# EAGLE design Dashboard rev3 (EAGLE 9.6.2)

## Sheet 1 of 2
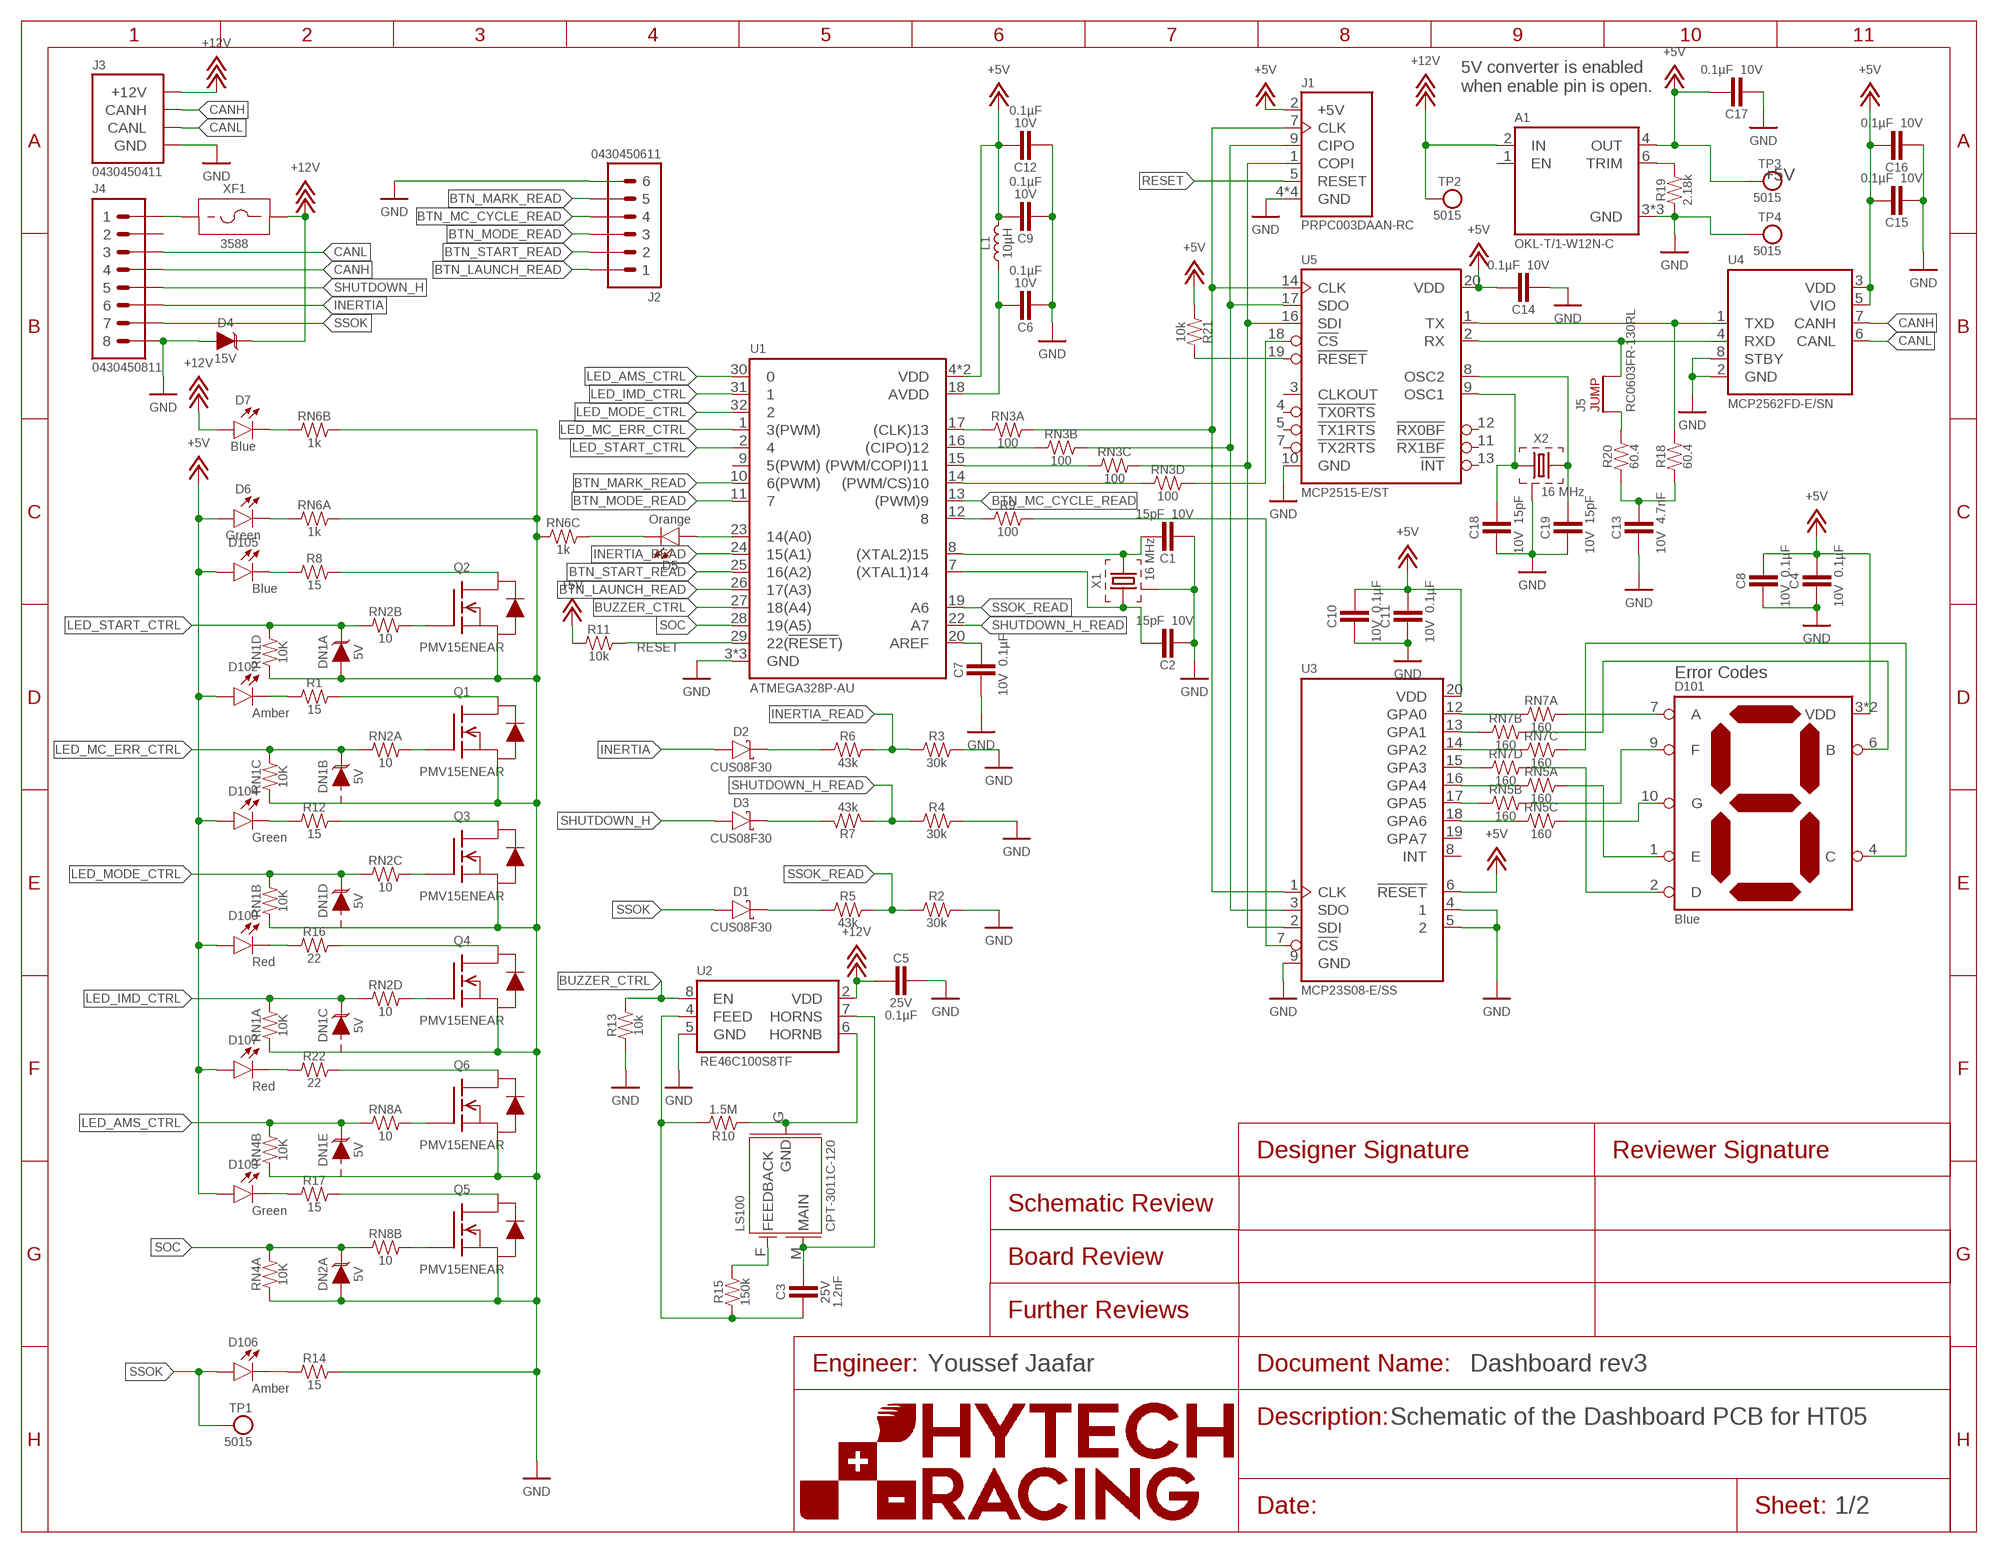
[diagram p0: schematic, sheet 1]

### Parts
A1  OKL-T/1-W12N-COKL  [OKL-T/1-W12]
C1  CAPACITOR_0603_10V_15PF  [0603-CAP]
C2  CAPACITOR_0603_10V_15PF  [0603-CAP]
C3  CAPACITOR_0603_25V_1.2NF  [0603-CAP]
C4  CAPACITOR_0603_10V_0.1UF  [0603-CAP]
C5  CAPACITOR_0603_25V_0.1UF  [0603-CAP]
C6  CAPACITOR_0603_10V_0.1UF  [0603-CAP]
C7  CAPACITOR_0603_10V_0.1UF  [0603-CAP]
C8  CAPACITOR_0603_10V_0.1UF  [0603-CAP]
C9  CAPACITOR_0603_10V_0.1UF  [0603-CAP]
C10  CAPACITOR_0603_10V_0.1UF  [0603-CAP]
C11  CAPACITOR_0603_10V_0.1UF  [0603-CAP]
C12  CAPACITOR_0603_10V_0.1UF  [0603-CAP]
C13  CAPACITOR_0603_10V_4.7NF  [0603-CAP]
C14  CAPACITOR_0603_10V_0.1UF  [0603-CAP]
C15  CAPACITOR_0603_10V_0.1UF  [0603-CAP]
C16  CAPACITOR_0603_10V_0.1UF  [0603-CAP]
C17  CAPACITOR_0603_10V_0.1UF  [0603-CAP]
C18  CAPACITOR_0603_10V_15PF  [0603-CAP]
C19  CAPACITOR_0603_10V_15PF  [0603-CAP]
D1  SCHOTTKY_SOD323_30V  [SOD-323]
D2  SCHOTTKY_SOD323_30V  [SOD-323]
D3  SCHOTTKY_SOD323_30V  [SOD-323]
D4  TVS_15V  [SOT-23]
D5  LED_0603_ORANGE  [0603-LED]
D6  LED_0603_GREEN  [0603-LED]
D7  LED_0603_BLUE  [0603-LED]
D100  LED_2835_RED  [2835-LED]
D101  LED_7_SEGMENT_BLUE_DSM7TA  [DSM7T]
D102  LED_2835_AMBER  [2835-LED]
D103  LED_2835_GREEN  [2835-LED]
D104  LED_2835_GREEN  [2835-LED]
D105  LED_2835_BLUE  [2835-LED]
D106  LED_2835_AMBER  [2835-LED]
D107  LED_2835_RED  [2835-LED]
DN1  TVS_ARRAY_5V  [SOT-363]
DN2  TVS_ARRAY_5V  [SOT-363]
J1  CONNECTOR-AVR-ISP_2X05_SMD  [2X05_SMD]
J2  CONNECTOR-6_μF_S_RA_  [MOLEX_MICROFIT_SMD_RIGHTANGLE_06_DUAL]
J3  CONNECTOR-CAN_μF_S_RA_  [MOLEX_MICROFIT_SMD_RIGHTANGLE_04_DUAL]
J4  CONNECTOR-8_μF_S_RA_  [MOLEX_MICROFIT_SMD_RIGHTANGLE_08_DUAL]
J5  JUMPER_0603_  [0603-RES]
L1  INDUCTOR_LQM18DH100M70_10UH  [0603-IND]
LS100  BUZZER_3_PIN_CPT-3011C-120  [CPT-3011C-120]
Q1  TRANSISTOR_N_MOS__PMV15ENEA  [SOT-23]
Q2  TRANSISTOR_N_MOS__PMV15ENEA  [SOT-23]
Q3  TRANSISTOR_N_MOS__PMV15ENEA  [SOT-23]
Q4  TRANSISTOR_N_MOS__PMV15ENEA  [SOT-23]
Q5  TRANSISTOR_N_MOS__PMV15ENEA  [SOT-23]
Q6  TRANSISTOR_N_MOS__PMV15ENEA  [SOT-23]
R1  RESISTOR_0603_15  [0603-RES]
R2  RESISTOR_0603_30K  [0603-RES]
R3  RESISTOR_0603_30K  [0603-RES]
R4  RESISTOR_0603_30K  [0603-RES]
R5  RESISTOR_0603_43K  [0603-RES]
R6  RESISTOR_0603_43K  [0603-RES]
R7  RESISTOR_0603_43K  [0603-RES]
R8  RESISTOR_0603_15  [0603-RES]
R9  RESISTOR_0603_100  [0603-RES]
R10  RESISTOR_0603_1.5M  [0603-RES]
R11  RESISTOR_0603_10K  [0603-RES]
R12  RESISTOR_0603_15  [0603-RES]
R13  RESISTOR_0603_10K  [0603-RES]
R14  RESISTOR_0603_15  [0603-RES]
R15  RESISTOR_0603_150K  [0603-RES]
R16  RESISTOR_0805_22  [0805-RES]
R17  RESISTOR_0603_15  [0603-RES]
R18  RESISTOR_0603_60.4  [0603-RES]
R19  RESISTOR_0603_2.18K  [0603-RES]
R20  RESISTOR_0603_60.4  [0603-RES]
R21  RESISTOR_0603_10K  [0603-RES]
R22  RESISTOR_0805_22  [0805-RES]
RN1  RESISTOR_NETWORK_4_10K  [1206-RES-ARRAY]
RN2  RESISTOR_NETWORK_4_10  [1206-RES-ARRAY]
RN3  RESISTOR_NETWORK_4_100  [1206-RES-ARRAY]
RN4  RESISTOR_NETWORK_4_10K  [1206-RES-ARRAY]
RN5  RESISTOR_NETWORK_4_160  [1206-RES-ARRAY]
RN6  RESISTOR_NETWORK_4_1K  [1206-RES-ARRAY]
RN7  RESISTOR_NETWORK_4_160  [1206-RES-ARRAY]
RN8  RESISTOR_NETWORK_4_10  [1206-RES-ARRAY]
TP1  TEST_POINT  [5015]
TP2  TEST_POINT  [5015]
TP3  TEST_POINT  [5015]
TP4  TEST_POINT  [5015]
U1  ATMEGA328P-AU  [TQFP-32]
U2  RE46C100  [SOIC-08(NARROW,0.15")]
U3  MCP23S08  [SSOP-20]
U4  MCP2562FD  [SOIC-08(NARROW,0.15")]
U5  MCP2515  [TSSOP-20]
X1  CRYSTAL_16MHZ  [ECX-42]
X2  CRYSTAL_16MHZ  [ECX-42]
XF1  FUSE_HOLDER_MINIBLADESMD  [3588]

### Nets
+5V: A1.4(OUT) C4.1 C8.1 C9.1 C10.1 C11.1 C12.1 C14.1 C15.1 C16.1 C17.1 D6.2(A) D100.A D101.3(VDD) D101.8(VDD) D102.A D103.A D104.A D105.A D107.A J1.2(+5V) L1.2 R11.1 R21.1 TP3.1 U1.4(VDD) U1.6(VDD) U3.6(!RESET) U3.20(VDD) U4.3(VDD) U4.5(VIO) U5.20(VDD)
+12V: A1.2(IN) C5.2 D4.3(C) D7.2(A) J3.1(+12V) TP2.1 U2.2(VDD) XF1.3 XF1.4
A2: RN7.1 U3.12(GPA0)
B2: RN7.2 U3.13(GPA1)
BTN_LAUNCH_READ: J2.1 U1.26(17(A3))
BTN_MARK_READ: J2.5 U1.10(6(PWM))
BTN_MC_CYCLE_READ: J2.4 U1.13((PWM)9)
BTN_MODE_READ: J2.3 U1.11
BTN_START_READ: J2.2 U1.25(16(A2))
BUZZER_CTRL: R13.2 U1.27(18(A4)) U2.8(EN)
C2: RN7.3 U3.14(GPA2)
CANH: J3.4(CANH) J4.4 U4.7(CANH)
CANL: J3.3(CANL) J4.3 U4.6(CANL)
D2: RN7.4 U3.15(GPA3)
E2: RN5.1 U3.16(GPA4)
F2: RN5.2 U3.17(GPA5)
G2: RN5.3 U3.18(GPA6)
GND: A1.3(GND) A1.7(GND) A1.11(GND) C1.2 C2.2 C4.2 C5.1 C6.2 C7.2 C8.2 C9.2 C10.2 C11.2 C12.2 C13.2 C14.2 C15.2 C16.2 C17.2 C18.2 C19.2 D4.1(A) DN1.2(A:A) DN2.2(A:A) J1.4(GND) J1.6(GND) J1.8(GND) J1.10(GND) J2.6 J3.2(GND) J4.8 Q1.2(S) Q2.2(S) Q3.2(S) Q4.2(S) Q5.2(S) Q6.2(S) R2.2 R3.2 R4.2 R13.1 R14.2 R19.1 RN1.1 RN1.2 RN1.3 RN1.4 RN4.1 RN4.2 RN6.3 RN6.7 RN6.8 TP4.1 U1.3(GND) U1.5(GND) U1.21(GND) U2.5(GND) U3.4 U3.5 U3.9(GND) U4.2(GND) U4.8(STBY) U5.10(GND) X1.2(GND) X1.4(GND) X2.2(GND) X2.4(GND)
INERTIA: D2.A J4.6
INERTIA_READ: R3.1 R6.2 U1.24(15(A1))
LED_AMS_CTRL: DN1.6(E:C) RN4.7 RN8.1 U1.30
LED_IMD_CTRL: DN1.4(C:C) RN1.8 RN2.4 U1.31
LED_MC_ERR_CTRL: DN1.3(B:C) RN1.6 RN2.1 U1.1(3(PWM))
LED_MODE_CTRL: DN1.5(D:C) RN1.7 RN2.3 U1.32
LED_START_CTRL: DN1.1(A:C) RN1.5 RN2.2 U1.2
N$1: C18.1 U5.9(OSC1) X2.1
N$2: D102.C R1.1
N$3: C1.1 U1.8((XTAL2)15) X1.3
N$4: C7.1 U1.20(AREF)
N$5: Q1.3(D) R1.2
N$6: Q3.3(D) R12.2
N$7: Q4.3(D) R16.2
N$8: Q6.3(D) R22.2
N$9: Q5.3(D) R17.2
N$10: Q2.1(G) RN2.7
N$11: C2.1 U1.7((XTAL1)14) X1.1
N$12: J1.7(CLK) RN3.8 U3.1(CLK) U5.14(CLK)
N$13: D101.7(A) RN7.8
N$14: D101.6(B) RN7.7
N$15: D101.4(C) RN7.6
N$16: D101.10(G) RN5.6
N$17: D101.9(F) RN5.7
N$18: D101.1(E) RN5.8
N$19: D101.2(D) RN7.5
N$20: RN3.4 U1.14((PWM/CS)10)
N$21: D6.1(C) RN6.1
N$22: Q1.1(G) RN2.8
N$23: J1.9(CIPO) RN3.7 U3.3(SDO) U5.17(SDO)
N$24: D104.C R12.1
N$25: D100.C R16.1
N$26: D106.C R14.1
N$27: D107.C R22.1
N$28: C3.1 LS100.M(MAIN) U2.7(HORNS)
N$29: R9.1 U1.12
N$30: A1.6(TRIM) R19.2
N$31: D105.C R8.1
N$32: D1.C R5.1
N$33: D3.C R7.1
N$34: Q2.3(D) R8.2
N$35: Q4.1(G) RN2.5
N$36: Q3.1(G) RN2.6
N$37: Q5.1(G) RN8.7
N$38: Q6.1(G) RN8.8
N$39: LS100.G(GND) R10.1 U2.6(HORNB)
N$40: D103.C R17.1
N$41: J5.2 U4.4(RXD) U5.2(RX)
N$42: C19.1 U5.8(OSC2) X2.3
N$43: J4.1 XF1.1 XF1.2
N$44: D5.2(A) U1.23(14(A0))
N$45: RN3.1 U1.17((CLK)13)
N$46: R21.2 U5.19(!RESET)
N$47: RN3.2 U1.16((CIPO)12)
N$48: RN3.3 U1.15((PWM/COPI)11)
N$50: C3.2 R10.2 R15.1 U2.4(FEED)
N$51: J5.1 R20.2
N$52: C13.1 R18.1 R20.1
N$53: R18.2 U4.1(TXD) U5.1(TX)
N$54: LS100.F(FEEDBACK) R15.2
N$56: J1.1(COPI) RN3.6 U3.2(SDI) U5.16(SDI)
N$57: RN3.5 U5.18(!CS)
N$59: R9.2 U3.7(!CS)
N$60: C6.1 L1.1 U1.18(AVDD)
N$69: D2.C R6.1
RESET: J1.5(RESET) R11.2 U1.29(22(!RESET!))
SHUTDOWN_H: D3.A J4.5
SHUTDOWN_H_READ: R4.1 R7.2 U1.22(A7)
SOC: DN2.1(A:C) RN4.8 RN8.2 U1.28(19(A5))
SSOK: D1.A D106.A J4.7 TP1.1
SSOK_READ: R2.1 R5.2 U1.19(A6)
STATUS_12V: D7.1(C) RN6.2
STATUS_TEENSY: D5.1(C) RN6.6
Unconnected: A1.1(EN) DN2.3(B:C) DN2.4(C:C) DN2.5(D:C) DN2.6(E:C) J4.2 RN4.3 RN4.4 RN4.5 RN4.6 RN5.4 RN5.5 RN6.4 RN6.5 RN8.3 RN8.4 RN8.5 RN8.6 U1.9(5(PWM)) U3.8(INT) U3.19(GPA7) U5.3(CLKOUT) U5.4(!TX0RTS) U5.5(!TX1RTS) U5.7(!TX2RTS) U5.11(!RX1BF) U5.12(!RX0BF) U5.13(!INT)

### Notes on the sheet
- 5V converter is enabled 
  when enable pin is open.
- Error Codes
- Youssef Jaafar
- Schematic of the Dashboard PCB for HT05

## Sheet 2 of 2
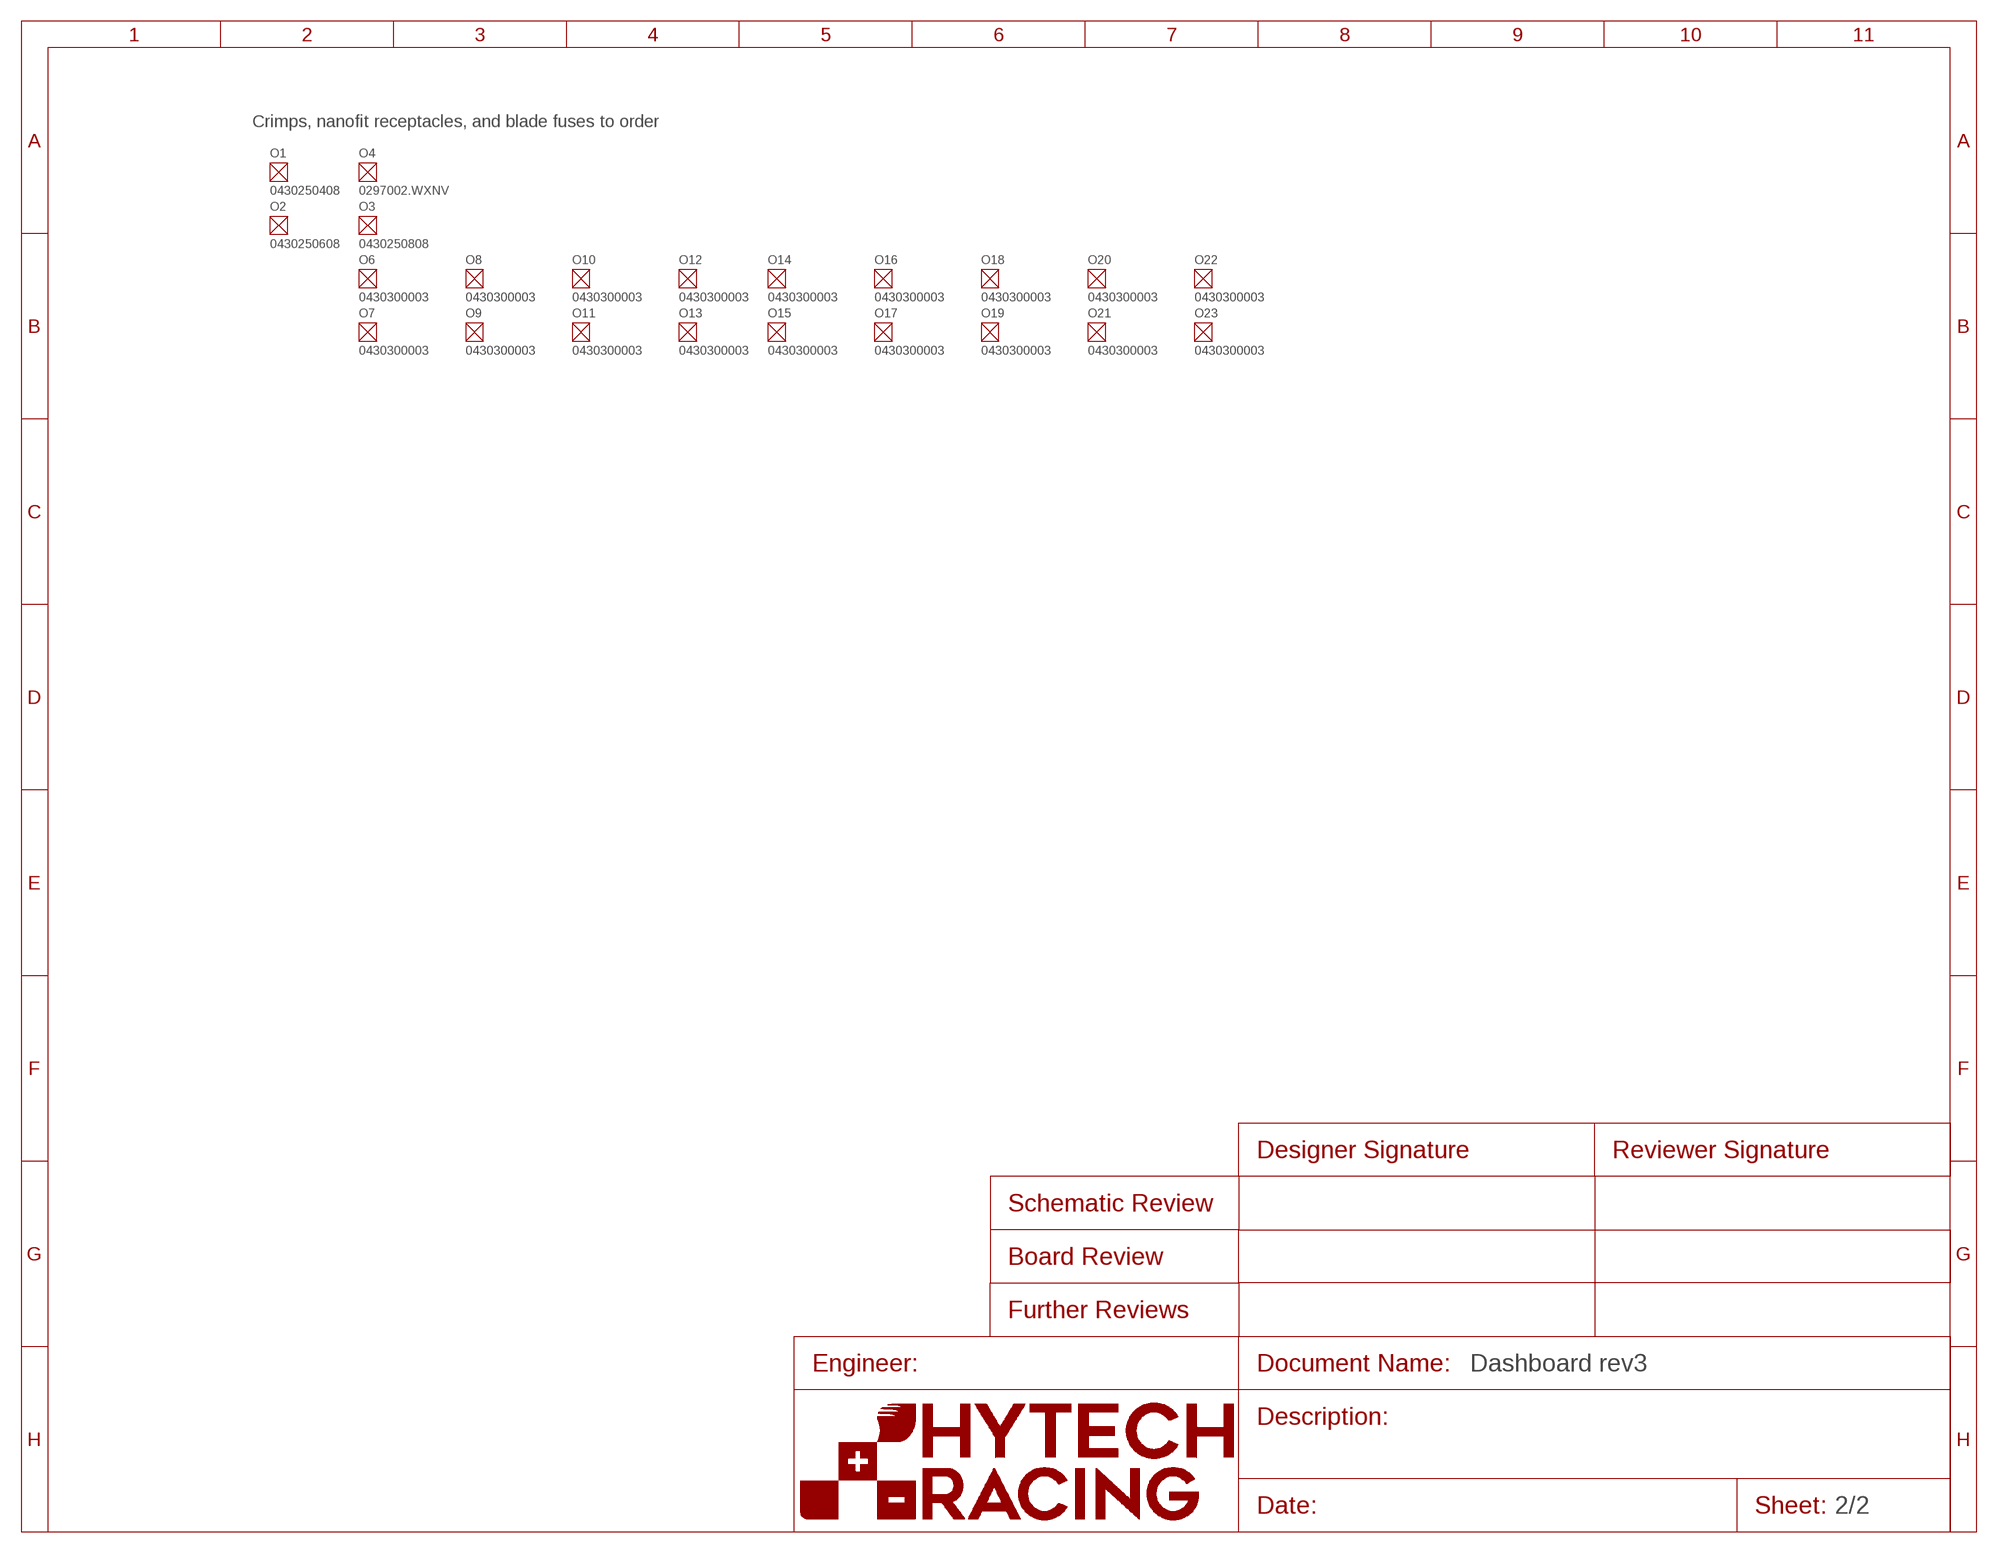
[diagram p1: schematic, sheet 2]
O1 (RECEPTACLE-4_MICROFIT): DKPN: WM11225-ND; MANUFACTURER: Molex; MOPN: 538-43025-0408; MPN: 0430250408
O2 (RECEPTACLE-6_MICROFIT): DKPN: WM13209-ND; MANUFACTURER: Molex; MOPN: 538-43025-0608; MPN: 0430250608
O3 (RECEPTACLE-8_MICROFIT): DKPN: WM13210-ND; MANUFACTURER: Molex; MOPN: 538-43025-0808; MPN: 0430250808
O4 (FUSE_MINI_BLADE_2): DKPN: F986-ND; MANUFACTURER: Littelfuse Inc.; MOPN: 576-0297002.WXNV; MPN: 0297002.WXNV
O6 (CRIMP_MICROFIT_20-24): DKPN: WM2776CT-ND; GAUGE: 20-24; MANUFACTURER: Molex; MOPN: 538-43030-0003; MPN: 0430300003
O7 (CRIMP_MICROFIT_20-24): DKPN: WM2776CT-ND; GAUGE: 20-24; MANUFACTURER: Molex; MOPN: 538-43030-0003; MPN: 0430300003
O8 (CRIMP_MICROFIT_20-24): DKPN: WM2776CT-ND; GAUGE: 20-24; MANUFACTURER: Molex; MOPN: 538-43030-0003; MPN: 0430300003
O9 (CRIMP_MICROFIT_20-24): DKPN: WM2776CT-ND; GAUGE: 20-24; MANUFACTURER: Molex; MOPN: 538-43030-0003; MPN: 0430300003
O10 (CRIMP_MICROFIT_20-24): DKPN: WM2776CT-ND; GAUGE: 20-24; MANUFACTURER: Molex; MOPN: 538-43030-0003; MPN: 0430300003
O11 (CRIMP_MICROFIT_20-24): DKPN: WM2776CT-ND; GAUGE: 20-24; MANUFACTURER: Molex; MOPN: 538-43030-0003; MPN: 0430300003
O12 (CRIMP_MICROFIT_20-24): DKPN: WM2776CT-ND; GAUGE: 20-24; MANUFACTURER: Molex; MOPN: 538-43030-0003; MPN: 0430300003
O13 (CRIMP_MICROFIT_20-24): DKPN: WM2776CT-ND; GAUGE: 20-24; MANUFACTURER: Molex; MOPN: 538-43030-0003; MPN: 0430300003
O14 (CRIMP_MICROFIT_20-24): DKPN: WM2776CT-ND; GAUGE: 20-24; MANUFACTURER: Molex; MOPN: 538-43030-0003; MPN: 0430300003
O15 (CRIMP_MICROFIT_20-24): DKPN: WM2776CT-ND; GAUGE: 20-24; MANUFACTURER: Molex; MOPN: 538-43030-0003; MPN: 0430300003
O16 (CRIMP_MICROFIT_20-24): DKPN: WM2776CT-ND; GAUGE: 20-24; MANUFACTURER: Molex; MOPN: 538-43030-0003; MPN: 0430300003
O17 (CRIMP_MICROFIT_20-24): DKPN: WM2776CT-ND; GAUGE: 20-24; MANUFACTURER: Molex; MOPN: 538-43030-0003; MPN: 0430300003
O18 (CRIMP_MICROFIT_20-24): DKPN: WM2776CT-ND; GAUGE: 20-24; MANUFACTURER: Molex; MOPN: 538-43030-0003; MPN: 0430300003
O19 (CRIMP_MICROFIT_20-24): DKPN: WM2776CT-ND; GAUGE: 20-24; MANUFACTURER: Molex; MOPN: 538-43030-0003; MPN: 0430300003
O20 (CRIMP_MICROFIT_20-24): DKPN: WM2776CT-ND; GAUGE: 20-24; MANUFACTURER: Molex; MOPN: 538-43030-0003; MPN: 0430300003
O21 (CRIMP_MICROFIT_20-24): DKPN: WM2776CT-ND; GAUGE: 20-24; MANUFACTURER: Molex; MOPN: 538-43030-0003; MPN: 0430300003
O22 (CRIMP_MICROFIT_20-24): DKPN: WM2776CT-ND; GAUGE: 20-24; MANUFACTURER: Molex; MOPN: 538-43030-0003; MPN: 0430300003
O23 (CRIMP_MICROFIT_20-24): DKPN: WM2776CT-ND; GAUGE: 20-24; MANUFACTURER: Molex; MOPN: 538-43030-0003; MPN: 0430300003

### Notes on the sheet
- Crimps, nanofit receptacles, and blade fuses to order

## Library data of the parts
A1 = HyTechDevices:OKL-*: Point of Load Voltage Regulator Modules OKL-T/1-W12 Datasheet <https://www.murata.com/products/productdata/8807038124062/okl-t1-w12.pdf?1583754815000>; DKPN: 811-2260-2-ND; MANUFACTURER: Murata Power Solutions Inc.; MOPN: 580-OKL-T/1-W12N-C; MPN: OKL-T/1-W12N-C; VIN: 12V; VOUT: 5V
C1 C2 C18 C19 = HyTechDevices:CAPACITOR_?_*: Capacitor, Non-Polarized VJ...1BC Series Datasheet <https://www.mouser.com/datasheet/2/427/vjw1bcbascomseries-1762447.pdf> Samsung Datasheet <https://www.mouser.com/datasheet/2/585/MLCC-1837944.pdf> Walsin Datasheet <https://www.mouser.com/datasheet/2/210/WTC_MLCC_General_Purpose-1534899.pdf> GRM188R61A226ME15D <https://www.mouser.com/datasheet/2/281/1/GRM188R61A226ME15_02A-1985787.pdf> GRM188R61E106MA73D <https://www.mouser.com/datasheet/2/281/1/GRM188R61E106MA73_01A-1985806.pdf> 885012006013 <https://www.mouser.com/datasheet/2/445/885012006013-1726946.pdf> 2220Y6300105KXTWS2 <https://www.mouser.com/datasheet/2/218/SMD_High_and_Std_StackiCap_P62-1825512.pdf> Yageo Class 2, X5R <https://www.mouser.com/datasheet/2/447/UPY_GPHC_X5R_4V_to_50V_26-1827097.pdf> TDK C Series <https://www.mouser.com/ProductDetail/TDK/C3216X5R1V226M160AC?qs=%2Fha2pyFadujbcx9jh7lYl%2F4NeMoXFhdc8AqVWNq4wW6M2y7zl6GzBuhgtI0ngznN> AVX Automotive MLCC <https://www.mouser.com/datasheet/2/40/AutoMLCC-777028.pdf> KEMET X7R Series <https://www.mouser.com/datasheet/2/212/KEM_C1002_X7R_SMD-1102033.pdf> Kyocera AVX <https://www.mouser.com/datasheet/2/40/C0GNP0_Dielectric-951274.pdf>; CAPACITANCE: 15pF; DKPN: 720-VJ0603A150FXQPW1BCCT-ND; MANUFACTURER: Vishay Vitramon; MOPN: 77-VJ0603A150FXQPBC; MPN: VJ0603A150FXQPW1BC; TOLERANCE: 1%; VOLTAGE: 10V
C3 = HyTechDevices:CAPACITOR_?_*: Capacitor, Non-Polarized VJ...1BC Series Datasheet <https://www.mouser.com/datasheet/2/427/vjw1bcbascomseries-1762447.pdf> Samsung Datasheet <https://www.mouser.com/datasheet/2/585/MLCC-1837944.pdf> Walsin Datasheet <https://www.mouser.com/datasheet/2/210/WTC_MLCC_General_Purpose-1534899.pdf> GRM188R61A226ME15D <https://www.mouser.com/datasheet/2/281/1/GRM188R61A226ME15_02A-1985787.pdf> GRM188R61E106MA73D <https://www.mouser.com/datasheet/2/281/1/GRM188R61E106MA73_01A-1985806.pdf> 885012006013 <https://www.mouser.com/datasheet/2/445/885012006013-1726946.pdf> 2220Y6300105KXTWS2 <https://www.mouser.com/datasheet/2/218/SMD_High_and_Std_StackiCap_P62-1825512.pdf> Yageo Class 2, X5R <https://www.mouser.com/datasheet/2/447/UPY_GPHC_X5R_4V_to_50V_26-1827097.pdf> TDK C Series <https://www.mouser.com/ProductDetail/TDK/C3216X5R1V226M160AC?qs=%2Fha2pyFadujbcx9jh7lYl%2F4NeMoXFhdc8AqVWNq4wW6M2y7zl6GzBuhgtI0ngznN> AVX Automotive MLCC <https://www.mouser.com/datasheet/2/40/AutoMLCC-777028.pdf> KEMET X7R Series <https://www.mouser.com/datasheet/2/212/KEM_C1002_X7R_SMD-1102033.pdf> Kyocera AVX <https://www.mouser.com/datasheet/2/40/C0GNP0_Dielectric-951274.pdf>; CAPACITANCE: 1.2nF; DKPN: 311-4079-2-ND; MANUFACTURER: YAGEO; MOPN: 603-CC603KRX7R8BB122; MPN: CC0603KRX7R8BB122; TOLERANCE: 10%; VOLTAGE: 25V
C4 C6-C12 C14-C17 = HyTechDevices:CAPACITOR_?_*: Capacitor, Non-Polarized VJ...1BC Series Datasheet <https://www.mouser.com/datasheet/2/427/vjw1bcbascomseries-1762447.pdf> Samsung Datasheet <https://www.mouser.com/datasheet/2/585/MLCC-1837944.pdf> Walsin Datasheet <https://www.mouser.com/datasheet/2/210/WTC_MLCC_General_Purpose-1534899.pdf> GRM188R61A226ME15D <https://www.mouser.com/datasheet/2/281/1/GRM188R61A226ME15_02A-1985787.pdf> GRM188R61E106MA73D <https://www.mouser.com/datasheet/2/281/1/GRM188R61E106MA73_01A-1985806.pdf> 885012006013 <https://www.mouser.com/datasheet/2/445/885012006013-1726946.pdf> 2220Y6300105KXTWS2 <https://www.mouser.com/datasheet/2/218/SMD_High_and_Std_StackiCap_P62-1825512.pdf> Yageo Class 2, X5R <https://www.mouser.com/datasheet/2/447/UPY_GPHC_X5R_4V_to_50V_26-1827097.pdf> TDK C Series <https://www.mouser.com/ProductDetail/TDK/C3216X5R1V226M160AC?qs=%2Fha2pyFadujbcx9jh7lYl%2F4NeMoXFhdc8AqVWNq4wW6M2y7zl6GzBuhgtI0ngznN> AVX Automotive MLCC <https://www.mouser.com/datasheet/2/40/AutoMLCC-777028.pdf> KEMET X7R Series <https://www.mouser.com/datasheet/2/212/KEM_C1002_X7R_SMD-1102033.pdf> Kyocera AVX <https://www.mouser.com/datasheet/2/40/C0GNP0_Dielectric-951274.pdf>; CAPACITANCE: 0.1µF; DKPN: 720-1688-1-ND; MANUFACTURER: Vishay Vitramon; MOPN: 77-VJ0603Y104JXQPBC; MPN: VJ0603Y104JXQPW1BC; TOLERANCE: 5%; VOLTAGE: 10V
C5 = HyTechDevices:CAPACITOR_?_*: Capacitor, Non-Polarized VJ...1BC Series Datasheet <https://www.mouser.com/datasheet/2/427/vjw1bcbascomseries-1762447.pdf> Samsung Datasheet <https://www.mouser.com/datasheet/2/585/MLCC-1837944.pdf> Walsin Datasheet <https://www.mouser.com/datasheet/2/210/WTC_MLCC_General_Purpose-1534899.pdf> GRM188R61A226ME15D <https://www.mouser.com/datasheet/2/281/1/GRM188R61A226ME15_02A-1985787.pdf> GRM188R61E106MA73D <https://www.mouser.com/datasheet/2/281/1/GRM188R61E106MA73_01A-1985806.pdf> 885012006013 <https://www.mouser.com/datasheet/2/445/885012006013-1726946.pdf> 2220Y6300105KXTWS2 <https://www.mouser.com/datasheet/2/218/SMD_High_and_Std_StackiCap_P62-1825512.pdf> Yageo Class 2, X5R <https://www.mouser.com/datasheet/2/447/UPY_GPHC_X5R_4V_to_50V_26-1827097.pdf> TDK C Series <https://www.mouser.com/ProductDetail/TDK/C3216X5R1V226M160AC?qs=%2Fha2pyFadujbcx9jh7lYl%2F4NeMoXFhdc8AqVWNq4wW6M2y7zl6GzBuhgtI0ngznN> AVX Automotive MLCC <https://www.mouser.com/datasheet/2/40/AutoMLCC-777028.pdf> KEMET X7R Series <https://www.mouser.com/datasheet/2/212/KEM_C1002_X7R_SMD-1102033.pdf> Kyocera AVX <https://www.mouser.com/datasheet/2/40/C0GNP0_Dielectric-951274.pdf>; CAPACITANCE: 0.1µF; DKPN: 1276-1006-1-ND; MANUFACTURER: Samsung Electro-Mechanics; MOPN: 187-CL10B104KA8NNNC; MPN: CL10B104KA8NNNC; TOLERANCE: 10%; VOLTAGE: 25V
C13 = HyTechDevices:CAPACITOR_?_*: Capacitor, Non-Polarized VJ...1BC Series Datasheet <https://www.mouser.com/datasheet/2/427/vjw1bcbascomseries-1762447.pdf> Samsung Datasheet <https://www.mouser.com/datasheet/2/585/MLCC-1837944.pdf> Walsin Datasheet <https://www.mouser.com/datasheet/2/210/WTC_MLCC_General_Purpose-1534899.pdf> GRM188R61A226ME15D <https://www.mouser.com/datasheet/2/281/1/GRM188R61A226ME15_02A-1985787.pdf> GRM188R61E106MA73D <https://www.mouser.com/datasheet/2/281/1/GRM188R61E106MA73_01A-1985806.pdf> 885012006013 <https://www.mouser.com/datasheet/2/445/885012006013-1726946.pdf> 2220Y6300105KXTWS2 <https://www.mouser.com/datasheet/2/218/SMD_High_and_Std_StackiCap_P62-1825512.pdf> Yageo Class 2, X5R <https://www.mouser.com/datasheet/2/447/UPY_GPHC_X5R_4V_to_50V_26-1827097.pdf> TDK C Series <https://www.mouser.com/ProductDetail/TDK/C3216X5R1V226M160AC?qs=%2Fha2pyFadujbcx9jh7lYl%2F4NeMoXFhdc8AqVWNq4wW6M2y7zl6GzBuhgtI0ngznN> AVX Automotive MLCC <https://www.mouser.com/datasheet/2/40/AutoMLCC-777028.pdf> KEMET X7R Series <https://www.mouser.com/datasheet/2/212/KEM_C1002_X7R_SMD-1102033.pdf> Kyocera AVX <https://www.mouser.com/datasheet/2/40/C0GNP0_Dielectric-951274.pdf>; CAPACITANCE: 4.7nF; DKPN: 732-7931-1-ND; MANUFACTURER: Würth Elektronik; MOPN: 710-885012206012; MPN: 885012206012; TOLERANCE: 10%; VOLTAGE: 10V
D1-D3 = HyTechDevices:SCHOTTKY_?_*: CUS08F30 Shottky Diode Datasheet <https://www.mouser.com/datasheet/2/408/CUS08F30_datasheet_en_20140414-1916097.pdf>; CURRENT: 0.8A; DKPN: CUS08F30H3FTR-ND; MANUFACTURER: Toshiba Semiconductor and Storage; MOPN: 757-CUS08F30H3F; MPN: CUS08F30; VOLTAGE: 30V
D4 = HyTechDevices:TVS_*: TVS Diode GSOT Datasheet <https://www.mouser.com/datasheet/2/427/gsot03-1767593.pdf>; DKPN: GSOT15-E3-08CT-ND; MANUFACTURER: Vishay General Semiconductor - Diodes Division; MOPN: 78-GSOT15-E3-08; MPN: GSOT15-E3-08; VOLTAGE: 15V
D5 = HyTechDevices:LED_?_*: LED 0603 Blue <https://www.mouser.com/datasheet/2/216/APT1608VBC_D-246010.pdf> Green <https://www.mouser.com/datasheet/2/216/APT1608ZGCK-1173388.pdf> Orange <https://www.mouser.com/datasheet/2/216/APT1608SECK-6197.pdf> Red <https://www.mouser.com/datasheet/2/216/APT1608SECK-J3-PRV-1173336.pdf> White <https://www.mouser.com/datasheet/2/50/SM0603UWC-880813.pdf> Yellow <https://www.mouser.com/datasheet/2/216/APT1608SYCK-J3-PRV-1173311.pdf> 2835 (Series not on Digikey) Lumiled LUXEON 2835 Color Line <https://www.mouser.com/datasheet/2/602/DS236_luxeon_2835_color_line_datasheet-1596094.pdf>; COLOR: Orange; DKPN: 754-1120-1-ND; MANUFACTURER: Kingbright; MOPN: 604-APT1608SECK; MPN: APT1608SECK
D6 = HyTechDevices:LED_?_*: LED 0603 Blue <https://www.mouser.com/datasheet/2/216/APT1608VBC_D-246010.pdf> Green <https://www.mouser.com/datasheet/2/216/APT1608ZGCK-1173388.pdf> Orange <https://www.mouser.com/datasheet/2/216/APT1608SECK-6197.pdf> Red <https://www.mouser.com/datasheet/2/216/APT1608SECK-J3-PRV-1173336.pdf> White <https://www.mouser.com/datasheet/2/50/SM0603UWC-880813.pdf> Yellow <https://www.mouser.com/datasheet/2/216/APT1608SYCK-J3-PRV-1173311.pdf> 2835 (Series not on Digikey) Lumiled LUXEON 2835 Color Line <https://www.mouser.com/datasheet/2/602/DS236_luxeon_2835_color_line_datasheet-1596094.pdf>; COLOR: Green; DKPN: 754-1790-1-ND; MANUFACTURER: Kingbright; MOPN: 604-APT1608ZGCK; MPN: APT1608ZGCK
D7 = HyTechDevices:LED_?_*: LED 0603 Blue <https://www.mouser.com/datasheet/2/216/APT1608VBC_D-246010.pdf> Green <https://www.mouser.com/datasheet/2/216/APT1608ZGCK-1173388.pdf> Orange <https://www.mouser.com/datasheet/2/216/APT1608SECK-6197.pdf> Red <https://www.mouser.com/datasheet/2/216/APT1608SECK-J3-PRV-1173336.pdf> White <https://www.mouser.com/datasheet/2/50/SM0603UWC-880813.pdf> Yellow <https://www.mouser.com/datasheet/2/216/APT1608SYCK-J3-PRV-1173311.pdf> 2835 (Series not on Digikey) Lumiled LUXEON 2835 Color Line <https://www.mouser.com/datasheet/2/602/DS236_luxeon_2835_color_line_datasheet-1596094.pdf>; COLOR: Blue; DKPN: 754-1789-1-ND; MANUFACTURER: Kingbright; MOPN: 604-APT1608VBC/D; MPN: APT1608VBC/D
D100 D107 = HyTechDevices:LED_?_*: LED 0603 Blue <https://www.mouser.com/datasheet/2/216/APT1608VBC_D-246010.pdf> Green <https://www.mouser.com/datasheet/2/216/APT1608ZGCK-1173388.pdf> Orange <https://www.mouser.com/datasheet/2/216/APT1608SECK-6197.pdf> Red <https://www.mouser.com/datasheet/2/216/APT1608SECK-J3-PRV-1173336.pdf> White <https://www.mouser.com/datasheet/2/50/SM0603UWC-880813.pdf> Yellow <https://www.mouser.com/datasheet/2/216/APT1608SYCK-J3-PRV-1173311.pdf> 2835 (Series not on Digikey) Lumiled LUXEON 2835 Color Line <https://www.mouser.com/datasheet/2/602/DS236_luxeon_2835_color_line_datasheet-1596094.pdf>; COLOR: Red; MANUFACTURER: Lumileds; MOPN: 997-L128RED10350; MPN: L128-RED1003500000
D101 = HyTechDevices:LED_7_SEGMENT_: Low-Profile 7-Segment Display DSM7T Blue <https://vcclite.com/wp-content/uploads/wpallimport/files/files/DSM7TA56106T.pdf> DSM7T Green <https://vcclite.com/wp-content/uploads/wpallimport/files/files/DSM7TA56105T.pdf>; COLOR: Blue; DKPN: DSM7TA56106TTR-ND; MANUFACTURER: Visual Communications Company; MOPN: 593-DSM7TA56106T; MPN: DSM7TA56106T
D102 D106 = HyTechDevices:LED_?_*: LED 0603 Blue <https://www.mouser.com/datasheet/2/216/APT1608VBC_D-246010.pdf> Green <https://www.mouser.com/datasheet/2/216/APT1608ZGCK-1173388.pdf> Orange <https://www.mouser.com/datasheet/2/216/APT1608SECK-6197.pdf> Red <https://www.mouser.com/datasheet/2/216/APT1608SECK-J3-PRV-1173336.pdf> White <https://www.mouser.com/datasheet/2/50/SM0603UWC-880813.pdf> Yellow <https://www.mouser.com/datasheet/2/216/APT1608SYCK-J3-PRV-1173311.pdf> 2835 (Series not on Digikey) Lumiled LUXEON 2835 Color Line <https://www.mouser.com/datasheet/2/602/DS236_luxeon_2835_color_line_datasheet-1596094.pdf>; COLOR: Amber; MANUFACTURER: Lumileds; MOPN: 997-L128PCA10350; MPN: L128-PCA1003500000
D103 D104 = HyTechDevices:LED_?_*: LED 0603 Blue <https://www.mouser.com/datasheet/2/216/APT1608VBC_D-246010.pdf> Green <https://www.mouser.com/datasheet/2/216/APT1608ZGCK-1173388.pdf> Orange <https://www.mouser.com/datasheet/2/216/APT1608SECK-6197.pdf> Red <https://www.mouser.com/datasheet/2/216/APT1608SECK-J3-PRV-1173336.pdf> White <https://www.mouser.com/datasheet/2/50/SM0603UWC-880813.pdf> Yellow <https://www.mouser.com/datasheet/2/216/APT1608SYCK-J3-PRV-1173311.pdf> 2835 (Series not on Digikey) Lumiled LUXEON 2835 Color Line <https://www.mouser.com/datasheet/2/602/DS236_luxeon_2835_color_line_datasheet-1596094.pdf>; COLOR: Green; MANUFACTURER: Lumileds; MOPN: 997-L128GRN10350; MPN: L128-GRN1003500000
D105 = HyTechDevices:LED_?_*: LED 0603 Blue <https://www.mouser.com/datasheet/2/216/APT1608VBC_D-246010.pdf> Green <https://www.mouser.com/datasheet/2/216/APT1608ZGCK-1173388.pdf> Orange <https://www.mouser.com/datasheet/2/216/APT1608SECK-6197.pdf> Red <https://www.mouser.com/datasheet/2/216/APT1608SECK-J3-PRV-1173336.pdf> White <https://www.mouser.com/datasheet/2/50/SM0603UWC-880813.pdf> Yellow <https://www.mouser.com/datasheet/2/216/APT1608SYCK-J3-PRV-1173311.pdf> 2835 (Series not on Digikey) Lumiled LUXEON 2835 Color Line <https://www.mouser.com/datasheet/2/602/DS236_luxeon_2835_color_line_datasheet-1596094.pdf>; COLOR: Blue; MANUFACTURER: Lumileds; MOPN: 997-L128BLU10350; MPN: L128-BLU1003500000
DN1 DN2 = HyTechDevices:TVS_ARRAY_*: TVS Diode Array Datasheet <https://www.mouser.com/datasheet/2/427/vesd05a5-06gtovesd26a5-06g-1768003.pdf>; DKPN: 112-VESD05A5-06G-G3-08CT-ND; MANUFACTURER: Vishay General Semiconductor - Diodes Division; MOPN: 78-VESD05A5-06G-G308; MPN: VESD05A5-06G-G3-08; VOLTAGE: 5V
J1 = HyTechDevices:CONNECTOR-AVR-ISP_?: AVR ISP 6-pin Header Reference <https://en.wikipedia.org/wiki/In-system_programming>; DKPN: S2011EC-03-ND; MANUFACTURER: Sullins Connector Solutions; MPN: PRPC003DAAN-RC
J2 = HyTechDevices:CONNECTOR-6_?_*: 6 Pin Connector; DKPN: WM1833CT-ND; MANUFACTURER: Molex; MOPN: 538-43045-0611; MPN: 0430450611
J3 = HyTechDevices:CONNECTOR-CAN_?_*: HyTech CAN Connector; DKPN: WM1832CT-ND; MANUFACTURER: Molex; MOPN: 538-43045-0411; MPN: 0430450411
J4 = HyTechDevices:CONNECTOR-8_?_*: 8 Pin Connector; DKPN: WM1834CT-ND; MANUFACTURER: Molex; MOPN: 538-43045-0811; MPN: 0430450811
J5 = HyTechDevices:JUMPER_?_*: 2 Pin Connector; DKPN: 13-RC0603FR-130RLTR-ND; MANUFACTURER: YAGEO; MOPN: 603-RC0603FR-130RL; MPN: RC0603FR-130RL
L1 = HyTechDevices:INDUCTOR_?_*: Inductor LQM18DH100M70 Datasheet <https://search.murata.co.jp/Ceramy/image/img/P02/JELF243B-9127.pdf> 74451133 Datasheet <https://www.we-online.com/catalog/datasheet/74451133.pdf> SRU1408 Datasheet <https://www.mouser.com/datasheet/2/54/SRU1048-1391431.pdf>; CURRENT_RATED: 300mA; CURRENT_SATURATION: 100mA; DCR: 1.37Ω; DKPN: 490-LQM18DH100M70LTR-ND; INDUCTANCE: 10µH; MANUFACTURER: Murata Electronics; MOPN: 81-LQM18DH100M70L; MPN: LQM18DH100M70L; TOLERANCE: 20%
LS100 = HyTechDevices:BUZZER_3_PIN_: 3 Pin Buzzer CPT-3011C-120 Datasheet <https://www.cuidevices.com/product/resource/cpt-3011c-120.pdf>; DKPN: 102-3762-ND; FREQUENCY: 3kHz; MANUFACTURER: CUI Devices; MOPN: 490-CPT-3011C-120; MPN: CPT-3011C-120; VOLTAGE: 12V; VOLUME: 85dB
Q1-Q6 = HyTechDevices:TRANSISTOR_N_MOS_?_*: N-MOSFET PMV15ENEA Datasheet <https://www.mouser.com/datasheet/2/916/PMV15ENEA-1604828.pdf> TK6P65W Datasheet <https://www.mouser.com/datasheet/2/408/TK6P65W_datasheet_en_20151225-1916290.pdf> SIR638ADP Datasheet <https://www.mouser.com/datasheet/2/427/sir638adp-1766131.pdf>; DKPN: 1727-8588-1-ND; MANUFACTURER: Nexperia USA Inc.; MOPN: 771-PMV15ENEAR; MPN: PMV15ENEAR
R1 R8 R12 R14 R17 = HyTechDevices:RESISTOR_?_*: Resistor PWR163 Series <https://www.mouser.com/datasheet/2/54/pwr163-777985.pdf> AC Series <https://www.mouser.com/datasheet/2/447/Yageo_PYu_AC_51_RoHS_L_7_1714230-1874691.pdf> PU Series <https://www.mouser.com/datasheet/2/447/PYu-PU_51_RoHS_L_6-1504619.pdf> ERA Series <https://www.mouser.com/datasheet/2/315/AOA0000C307-1149632.pdf> PWR263 Series <https://www.mouser.com/datasheet/2/54/pwr263s_35-778069.pdf> RC Series <https://www.mouser.com/datasheet/2/447/Yageo_03_18_2021_PYu_RC_Group_51_RoHS_L_11-2199992.pdf> ERJ PB3, PB6 Series <https://www.mouser.com/datasheet/2/315/AOA0000C328-1530132.pdf> ERJ PA2, P03, PA3, P06, P08, P14 Series <https://www.mouser.com/datasheet/2/315/AOA0000C331-1141874.pdf>; DKPN: 541-15.0STR-ND; MANUFACTURER: Vishay Dale; MOPN: 71-CRCW060315R0FKEAH; MPN: CRCW060315R0FKEAHP; POWER: 0.33W; RESISTANCE: 15; TOLERANCE: 1%; VOLTAGE_CONTINUOUS: 2.22V; VOLTAGE_MAX: 75V
R2-R4 = HyTechDevices:RESISTOR_?_*: Resistor PWR163 Series <https://www.mouser.com/datasheet/2/54/pwr163-777985.pdf> AC Series <https://www.mouser.com/datasheet/2/447/Yageo_PYu_AC_51_RoHS_L_7_1714230-1874691.pdf> PU Series <https://www.mouser.com/datasheet/2/447/PYu-PU_51_RoHS_L_6-1504619.pdf> ERA Series <https://www.mouser.com/datasheet/2/315/AOA0000C307-1149632.pdf> PWR263 Series <https://www.mouser.com/datasheet/2/54/pwr263s_35-778069.pdf> RC Series <https://www.mouser.com/datasheet/2/447/Yageo_03_18_2021_PYu_RC_Group_51_RoHS_L_11-2199992.pdf> ERJ PB3, PB6 Series <https://www.mouser.com/datasheet/2/315/AOA0000C328-1530132.pdf> ERJ PA2, P03, PA3, P06, P08, P14 Series <https://www.mouser.com/datasheet/2/315/AOA0000C331-1141874.pdf>; DKPN: P30KBDCT-ND; MANUFACTURER: Panasonic Electronic Components; MOPN: 667-ERA-3ARB303V; MPN: ERA-3ARB303V; POWER: 0.1W; RESISTANCE: 30k; TOLERANCE: 0.1%; VOLTAGE_CONTINUOUS: 54.77V; VOLTAGE_MAX: 75V
R5-R7 = HyTechDevices:RESISTOR_?_*: Resistor PWR163 Series <https://www.mouser.com/datasheet/2/54/pwr163-777985.pdf> AC Series <https://www.mouser.com/datasheet/2/447/Yageo_PYu_AC_51_RoHS_L_7_1714230-1874691.pdf> PU Series <https://www.mouser.com/datasheet/2/447/PYu-PU_51_RoHS_L_6-1504619.pdf> ERA Series <https://www.mouser.com/datasheet/2/315/AOA0000C307-1149632.pdf> PWR263 Series <https://www.mouser.com/datasheet/2/54/pwr263s_35-778069.pdf> RC Series <https://www.mouser.com/datasheet/2/447/Yageo_03_18_2021_PYu_RC_Group_51_RoHS_L_11-2199992.pdf> ERJ PB3, PB6 Series <https://www.mouser.com/datasheet/2/315/AOA0000C328-1530132.pdf> ERJ PA2, P03, PA3, P06, P08, P14 Series <https://www.mouser.com/datasheet/2/315/AOA0000C331-1141874.pdf>; DKPN: 311-43.0KHRCT-ND; MANUFACTURER: Yageo; MOPN: 603-RC0603FR-0743KL; MPN: RC0603FR-0743KL; POWER: 0.1W; RESISTANCE: 43k; TOLERANCE: 1%; VOLTAGE_CONTINUOUS: 65.57V; VOLTAGE_MAX: 75V
R9 = HyTechDevices:RESISTOR_?_*: Resistor PWR163 Series <https://www.mouser.com/datasheet/2/54/pwr163-777985.pdf> AC Series <https://www.mouser.com/datasheet/2/447/Yageo_PYu_AC_51_RoHS_L_7_1714230-1874691.pdf> PU Series <https://www.mouser.com/datasheet/2/447/PYu-PU_51_RoHS_L_6-1504619.pdf> ERA Series <https://www.mouser.com/datasheet/2/315/AOA0000C307-1149632.pdf> PWR263 Series <https://www.mouser.com/datasheet/2/54/pwr263s_35-778069.pdf> RC Series <https://www.mouser.com/datasheet/2/447/Yageo_03_18_2021_PYu_RC_Group_51_RoHS_L_11-2199992.pdf> ERJ PB3, PB6 Series <https://www.mouser.com/datasheet/2/315/AOA0000C328-1530132.pdf> ERJ PA2, P03, PA3, P06, P08, P14 Series <https://www.mouser.com/datasheet/2/315/AOA0000C331-1141874.pdf>; DKPN: 311-100HRCT-ND; MANUFACTURER: Yageo; MOPN: 603-RC0603FR-07100RL; MPN: RC0603FR-07100RL; POWER: 0.1W; RESISTANCE: 100; TOLERANCE: 1%; VOLTAGE_CONTINUOUS: 3.16V; VOLTAGE_MAX: 75V
R10 = HyTechDevices:RESISTOR_?_*: Resistor PWR163 Series <https://www.mouser.com/datasheet/2/54/pwr163-777985.pdf> AC Series <https://www.mouser.com/datasheet/2/447/Yageo_PYu_AC_51_RoHS_L_7_1714230-1874691.pdf> PU Series <https://www.mouser.com/datasheet/2/447/PYu-PU_51_RoHS_L_6-1504619.pdf> ERA Series <https://www.mouser.com/datasheet/2/315/AOA0000C307-1149632.pdf> PWR263 Series <https://www.mouser.com/datasheet/2/54/pwr263s_35-778069.pdf> RC Series <https://www.mouser.com/datasheet/2/447/Yageo_03_18_2021_PYu_RC_Group_51_RoHS_L_11-2199992.pdf> ERJ PB3, PB6 Series <https://www.mouser.com/datasheet/2/315/AOA0000C328-1530132.pdf> ERJ PA2, P03, PA3, P06, P08, P14 Series <https://www.mouser.com/datasheet/2/315/AOA0000C331-1141874.pdf>; DKPN: 311-1.50MHRCT-ND; MANUFACTURER: Yageo; MOPN: 603-RC0603FR-071M5L; MPN: RC0603FR-071M5L; POWER: 0.1W; RESISTANCE: 1.5M; TOLERANCE: 1%; VOLTAGE_CONTINUOUS: 75V; VOLTAGE_MAX: 75V
R11 R13 R21 = HyTechDevices:RESISTOR_?_*: Resistor PWR163 Series <https://www.mouser.com/datasheet/2/54/pwr163-777985.pdf> AC Series <https://www.mouser.com/datasheet/2/447/Yageo_PYu_AC_51_RoHS_L_7_1714230-1874691.pdf> PU Series <https://www.mouser.com/datasheet/2/447/PYu-PU_51_RoHS_L_6-1504619.pdf> ERA Series <https://www.mouser.com/datasheet/2/315/AOA0000C307-1149632.pdf> PWR263 Series <https://www.mouser.com/datasheet/2/54/pwr263s_35-778069.pdf> RC Series <https://www.mouser.com/datasheet/2/447/Yageo_03_18_2021_PYu_RC_Group_51_RoHS_L_11-2199992.pdf> ERJ PB3, PB6 Series <https://www.mouser.com/datasheet/2/315/AOA0000C328-1530132.pdf> ERJ PA2, P03, PA3, P06, P08, P14 Series <https://www.mouser.com/datasheet/2/315/AOA0000C331-1141874.pdf>; DKPN: 311-10.0KHRCT-ND; MANUFACTURER: Yageo; MOPN: 603-RC0603FR-0710KL; MPN: RC0603FR-0710KL; POWER: 0.1W; RESISTANCE: 10k; TOLERANCE: 1%; VOLTAGE_CONTINUOUS: 31.62V; VOLTAGE_MAX: 75V
R15 = HyTechDevices:RESISTOR_?_*: Resistor PWR163 Series <https://www.mouser.com/datasheet/2/54/pwr163-777985.pdf> AC Series <https://www.mouser.com/datasheet/2/447/Yageo_PYu_AC_51_RoHS_L_7_1714230-1874691.pdf> PU Series <https://www.mouser.com/datasheet/2/447/PYu-PU_51_RoHS_L_6-1504619.pdf> ERA Series <https://www.mouser.com/datasheet/2/315/AOA0000C307-1149632.pdf> PWR263 Series <https://www.mouser.com/datasheet/2/54/pwr263s_35-778069.pdf> RC Series <https://www.mouser.com/datasheet/2/447/Yageo_03_18_2021_PYu_RC_Group_51_RoHS_L_11-2199992.pdf> ERJ PB3, PB6 Series <https://www.mouser.com/datasheet/2/315/AOA0000C328-1530132.pdf> ERJ PA2, P03, PA3, P06, P08, P14 Series <https://www.mouser.com/datasheet/2/315/AOA0000C331-1141874.pdf>; DKPN: P150KDBCT-ND; MANUFACTURER: Panasonic Electronic Components; MOPN: 667-ERA-3AEB154V; MPN: ERA-3AEB154V; POWER: 0.1W; RESISTANCE: 150k; TOLERANCE: 1%; VOLTAGE_CONTINUOUS: 75V; VOLTAGE_MAX: 75V
R16 R22 = HyTechDevices:RESISTOR_?_*: Resistor PWR163 Series <https://www.mouser.com/datasheet/2/54/pwr163-777985.pdf> AC Series <https://www.mouser.com/datasheet/2/447/Yageo_PYu_AC_51_RoHS_L_7_1714230-1874691.pdf> PU Series <https://www.mouser.com/datasheet/2/447/PYu-PU_51_RoHS_L_6-1504619.pdf> ERA Series <https://www.mouser.com/datasheet/2/315/AOA0000C307-1149632.pdf> PWR263 Series <https://www.mouser.com/datasheet/2/54/pwr263s_35-778069.pdf> RC Series <https://www.mouser.com/datasheet/2/447/Yageo_03_18_2021_PYu_RC_Group_51_RoHS_L_11-2199992.pdf> ERJ PB3, PB6 Series <https://www.mouser.com/datasheet/2/315/AOA0000C328-1530132.pdf> ERJ PA2, P03, PA3, P06, P08, P14 Series <https://www.mouser.com/datasheet/2/315/AOA0000C331-1141874.pdf>; DKPN: P16066TR-ND; MANUFACTURER: Panasonic Electronic Components; MOPN: 667-ERJ-P06F22R0V; MPN: ERJ-P06F22R0V; POWER: 0.5W; RESISTANCE: 22; TOLERANCE: 1%; VOLTAGE_CONTINUOUS: 3.32V; VOLTAGE_MAX: 400V
R18 R20 = HyTechDevices:RESISTOR_?_*: Resistor PWR163 Series <https://www.mouser.com/datasheet/2/54/pwr163-777985.pdf> AC Series <https://www.mouser.com/datasheet/2/447/Yageo_PYu_AC_51_RoHS_L_7_1714230-1874691.pdf> PU Series <https://www.mouser.com/datasheet/2/447/PYu-PU_51_RoHS_L_6-1504619.pdf> ERA Series <https://www.mouser.com/datasheet/2/315/AOA0000C307-1149632.pdf> PWR263 Series <https://www.mouser.com/datasheet/2/54/pwr263s_35-778069.pdf> RC Series <https://www.mouser.com/datasheet/2/447/Yageo_03_18_2021_PYu_RC_Group_51_RoHS_L_11-2199992.pdf> ERJ PB3, PB6 Series <https://www.mouser.com/datasheet/2/315/AOA0000C328-1530132.pdf> ERJ PA2, P03, PA3, P06, P08, P14 Series <https://www.mouser.com/datasheet/2/315/AOA0000C331-1141874.pdf>; DKPN: 311-60.4HRCT-ND; MANUFACTURER: Yageo; MOPN: 603-RC0603FR-0760R4L; MPN: RC0603FR-0760R4L; POWER: 0.1W; RESISTANCE: 60.4; TOLERANCE: 1%; VOLTAGE_CONTINUOUS: 2.48V; VOLTAGE_MAX: 75V
R19 = HyTechDevices:RESISTOR_?_*: Resistor PWR163 Series <https://www.mouser.com/datasheet/2/54/pwr163-777985.pdf> AC Series <https://www.mouser.com/datasheet/2/447/Yageo_PYu_AC_51_RoHS_L_7_1714230-1874691.pdf> PU Series <https://www.mouser.com/datasheet/2/447/PYu-PU_51_RoHS_L_6-1504619.pdf> ERA Series <https://www.mouser.com/datasheet/2/315/AOA0000C307-1149632.pdf> PWR263 Series <https://www.mouser.com/datasheet/2/54/pwr263s_35-778069.pdf> RC Series <https://www.mouser.com/datasheet/2/447/Yageo_03_18_2021_PYu_RC_Group_51_RoHS_L_11-2199992.pdf> ERJ PB3, PB6 Series <https://www.mouser.com/datasheet/2/315/AOA0000C328-1530132.pdf> ERJ PA2, P03, PA3, P06, P08, P14 Series <https://www.mouser.com/datasheet/2/315/AOA0000C331-1141874.pdf>; DKPN: 13-RT0805BRD072K18LTR-ND; MANUFACTURER: YAGEO; MOPN: 603-RT0805BRD072K18L; MPN: RT0805BRD072K18L; POWER: 0.125W; RESISTANCE: 2.18k; TOLERANCE: 0.1%; VOLTAGE_CONTINUOUS: 16.51V; VOLTAGE_MAX: 150V
RN1 RN4 = HyTechDevices:RESISTOR_NETWORK_4_*: Resistor Network, 4 Elements YC/TC Series <https://www.mouser.com/datasheet/2/447/yageo_yago_s_a0009164376_1-1991537.pdf> CAT/CAY 16 Series <https://www.mouser.com/datasheet/2/54/CATCAY-777361.pdf>; DKPN: YAG3410CT-ND; MANUFACTURER: Yageo; MOPN: 603-TC164-FR-0710KL; MPN: TC164-FR-0710KL; POWER: 1/16W; RESISTANCE: 10K; TOLERANCE: 1%; VOLTAGE: 50V
RN2 RN8 = HyTechDevices:RESISTOR_NETWORK_4_*: Resistor Network, 4 Elements YC/TC Series <https://www.mouser.com/datasheet/2/447/yageo_yago_s_a0009164376_1-1991537.pdf> CAT/CAY 16 Series <https://www.mouser.com/datasheet/2/54/CATCAY-777361.pdf>; DKPN: CAT16-100J4LFCT-ND; MANUFACTURER: Bourns Inc.; MOPN: 652-CAT16-100J4LF; MPN: CAT16-100J4LF; POWER: 1/16W; RESISTANCE: 10; TOLERANCE: 5%; VOLTAGE: 50V
RN3 = HyTechDevices:RESISTOR_NETWORK_4_*: Resistor Network, 4 Elements YC/TC Series <https://www.mouser.com/datasheet/2/447/yageo_yago_s_a0009164376_1-1991537.pdf> CAT/CAY 16 Series <https://www.mouser.com/datasheet/2/54/CATCAY-777361.pdf>; DKPN: CAT16-1000F4LFCT-ND; MANUFACTURER: Bourns Inc.; MOPN: 652-CAT16-1000F4LF; MPN: CAT16-1000F4LF; POWER: 1/16W; RESISTANCE: 100; TOLERANCE: 1%; VOLTAGE: 50V
RN5 RN7 = HyTechDevices:RESISTOR_NETWORK_4_*: Resistor Network, 4 Elements YC/TC Series <https://www.mouser.com/datasheet/2/447/yageo_yago_s_a0009164376_1-1991537.pdf> CAT/CAY 16 Series <https://www.mouser.com/datasheet/2/54/CATCAY-777361.pdf>; DKPN: YC164J-160CT-ND; MANUFACTURER: Yageo; MOPN: 603-YC164-JR-07160RL; MPN: YC164-JR-07160RL; POWER: 1/16W; RESISTANCE: 160; TOLERANCE: 5%; VOLTAGE: 50V
RN6 = HyTechDevices:RESISTOR_NETWORK_4_*: Resistor Network, 4 Elements YC/TC Series <https://www.mouser.com/datasheet/2/447/yageo_yago_s_a0009164376_1-1991537.pdf> CAT/CAY 16 Series <https://www.mouser.com/datasheet/2/54/CATCAY-777361.pdf>; DKPN: 13-YC164-FR-071KLCT-ND; MANUFACTURER: Yageo; MOPN: 603-YC164-FR-071KL; MPN: YC164-FR-071KL; POWER: 1/16W; RESISTANCE: 1k; TOLERANCE: 1%; VOLTAGE: 50V
TP1 = HyTechDevices:TEST_POINT: Test Point for Probing; DKPN: 36-5015CT-ND; MANUFACTURER: Keystone Electronics; MOPN: 534-5015; MPN: 5015; SIGNAL: SSOK
TP2 = HyTechDevices:TEST_POINT: Test Point for Probing; DKPN: 36-5015CT-ND; MANUFACTURER: Keystone Electronics; MOPN: 534-5015; MPN: 5015; SIGNAL: +12V
TP3 = HyTechDevices:TEST_POINT: Test Point for Probing; DKPN: 36-5015CT-ND; MANUFACTURER: Keystone Electronics; MOPN: 534-5015; MPN: 5015; SIGNAL: +5V
TP4 = HyTechDevices:TEST_POINT: Test Point for Probing; DKPN: 36-5015CT-ND; MANUFACTURER: Keystone Electronics; MOPN: 534-5015; MPN: 5015; SIGNAL: GND
U1 = HyTechDevices:ATMEGA328P-AU: ATmega328P Datasheet <https://www.mouser.com/datasheet/2/268/ATmega48A_PA_88A_PA_168A_PA_328_P_DS_DS40002061B-1900559.pdf>; DKPN: ATMEGA328P-AURCT-ND; MANUFACTURER: Microchip Technology; MOPN: 556-ATMEGA328P-AU; MPN: ATMEGA328P-AU
U2 = HyTechDevices:RE46C100: RE46C100 Piezoelectric Horn Driver IC Datasheet <https://ww1.microchip.com/downloads/en/DeviceDoc/20002166B.pdf>; DKPN: RE46C100S8TFTR-ND; MANUFACTURER: Microchip Technology; MOPN: 579-RE46C100S8TF; MPN: RE46C100S8TF
U3 = HyTechDevices:MCP23S08: IO Expander 8 Channel Datasheet <https://ww1.microchip.com/downloads/en/DeviceDoc/MCP23008-MCP23S08-Data-Sheet-20001919F.pdf>; DKPN: MCP23S08-E/SS-ND; MANUFACTURER: Microchip Technology; MOPN: 579-MCP23S08-E/SS; MPN: MCP23S08-E/SS
U4 = HyTechDevices:MCP2562FD: MCP2562FD Can Tranciever Datasheet <https://ww1.microchip.com/downloads/en/DeviceDoc/20005284A.pdf>; ALT_DKPN: MCP2562-E/SN-ND; ALT_MANUFACTURER: Microchip Technology; ALT_MOPN: 579-MCP2562-E/SN; ALT_MPN: MCP2562-E/SN; DKPN: MCP2562FD-E/SN-ND; MANUFACTURER: Microchip Technology; MOPN: 579-MCP2562FD-E/SN; MPN: MCP2562FD-E/SN
U5 = HyTechDevices:MCP2515: MCP2515 Can Controller Datasheet <https://www.mouser.com/datasheet/2/268/MCP2515-Stand-Alone-CAN-Controller-with-SPI-200018-708845.pdf>; DKPN: MCP2515-E/ST-ND; MANUFACTURER: Microchip Technology; MOPN: 579-MCP2515-E/ST; MPN: MCP2515-E/ST
X1 X2 = HyTechDevices:CRYSTAL_*: Crystal Datasheet <https://www.mouser.com/datasheet/2/122/ECX_42-12562.pdf> Recommended load capacitor for the ECS-160-10-42-CKM-TR: VJ0603A150FXQPW1BC <https://www.mouser.com/datasheet/2/427/vjw1bcbascomseries-1762447.pdf>; DKPN: XC2566CT-ND; FREQUENCY: 16 MHz; LOAD_CAPACITANCE: 10pF; MANUFACTURER: TXC CORPORATION; MOPN: 520-160-10-42-CKMT; MPN: ECS-160-10-42-CKM-TR; SHUNT_CAPACITANCE: 2 - 5 pF
XF1 = HyTechDevices:FUSE_HOLDER_*: Fuse Holder All PNs for the holder; if Miniblade Fuses <https://www.littelfuse.com/media?resourcetype=datasheets&itemid=0f5f58cb-559e-494b-8d53-723f30445ae5&filename=littelfuse-mini-datasheet> needed, order separately. Mini-Blade PTH <https://www.mouser.com/datasheet/2/215/3568-742601.pdf> Mini-Blade SMD <https://www.mouser.com/datasheet/2/215/588-744913.pdf>; DKPN: 36-3588-ND; MANUFACTURER: Keystone Electronics; MOPN: 534-3588; MPN: 3588

## Board
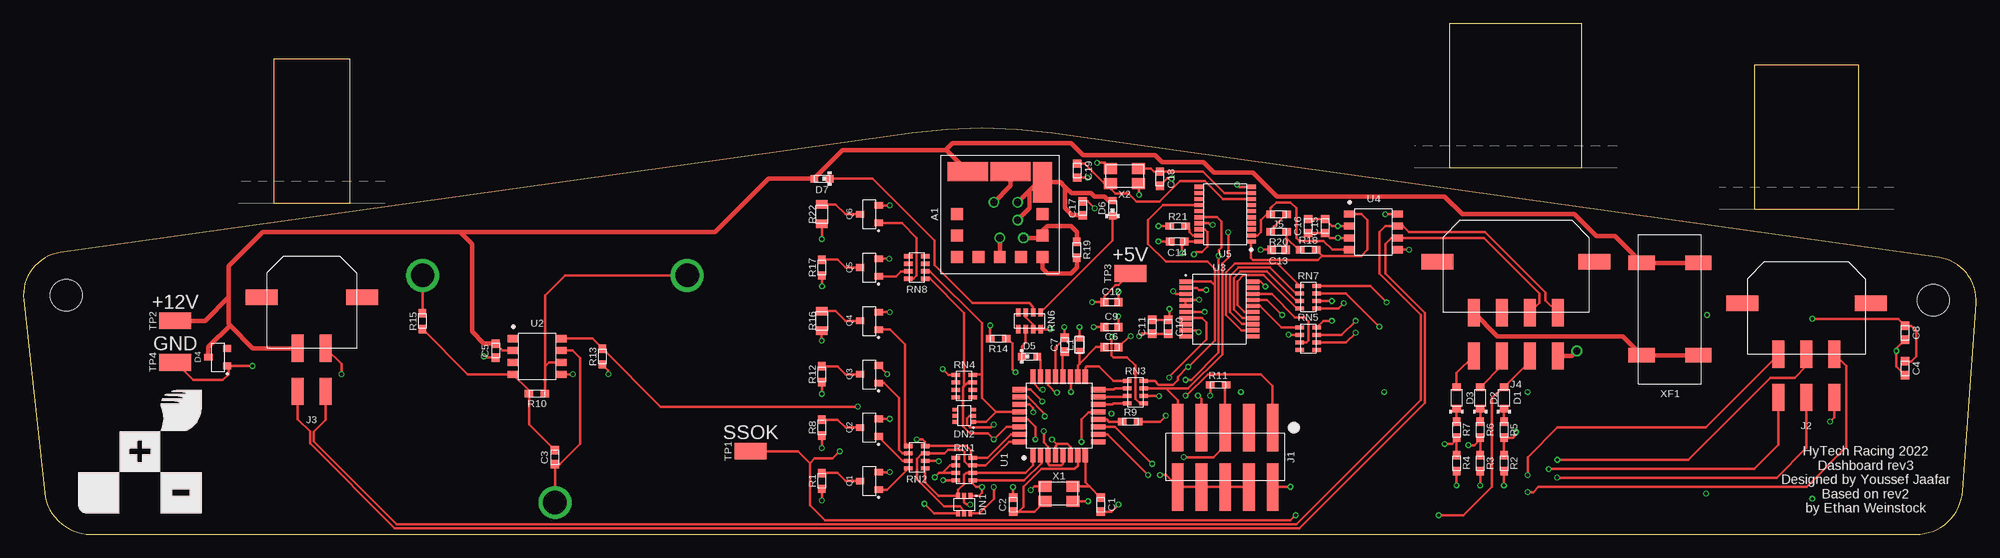
[diagram p2: board, top side]
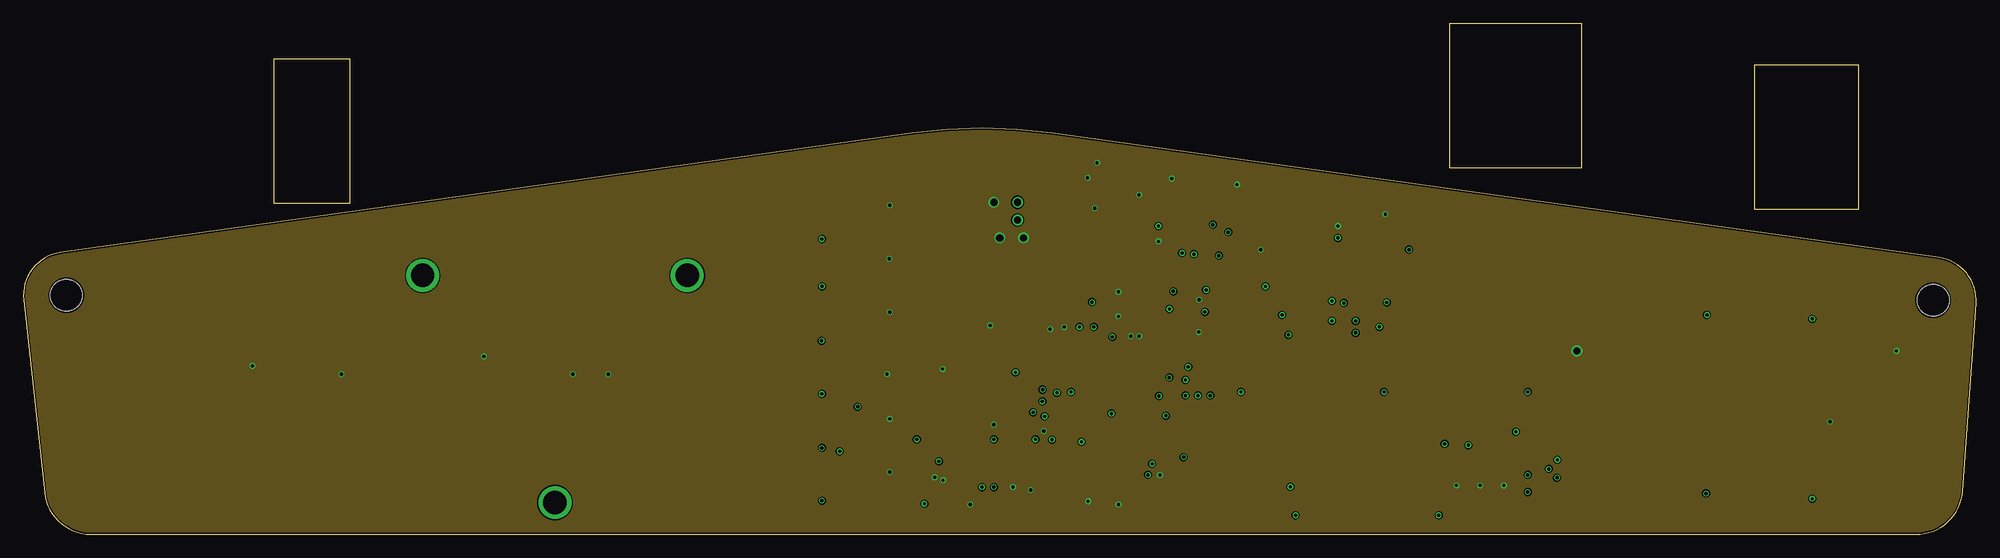
[diagram p3: board, inner layer Route2]
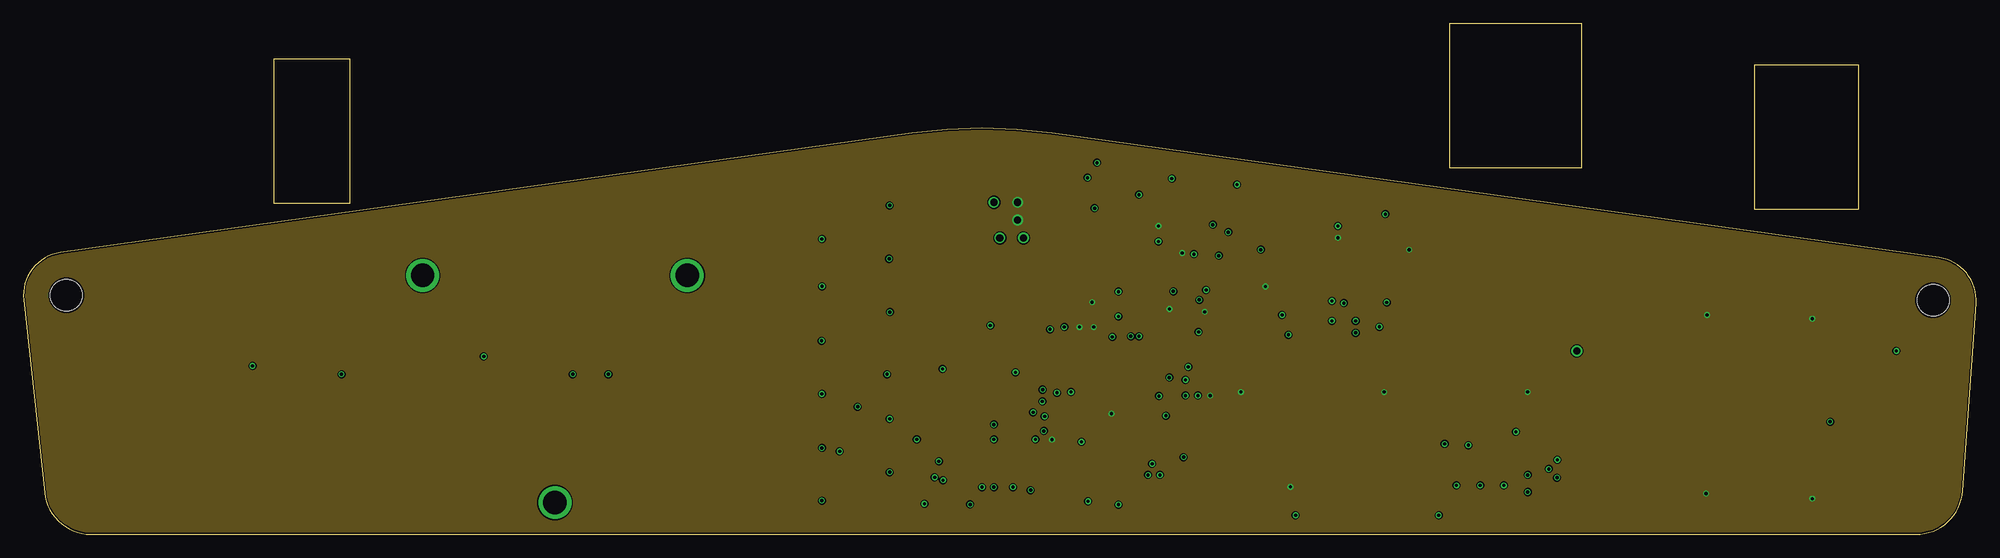
[diagram p4: board, inner layer Route15]
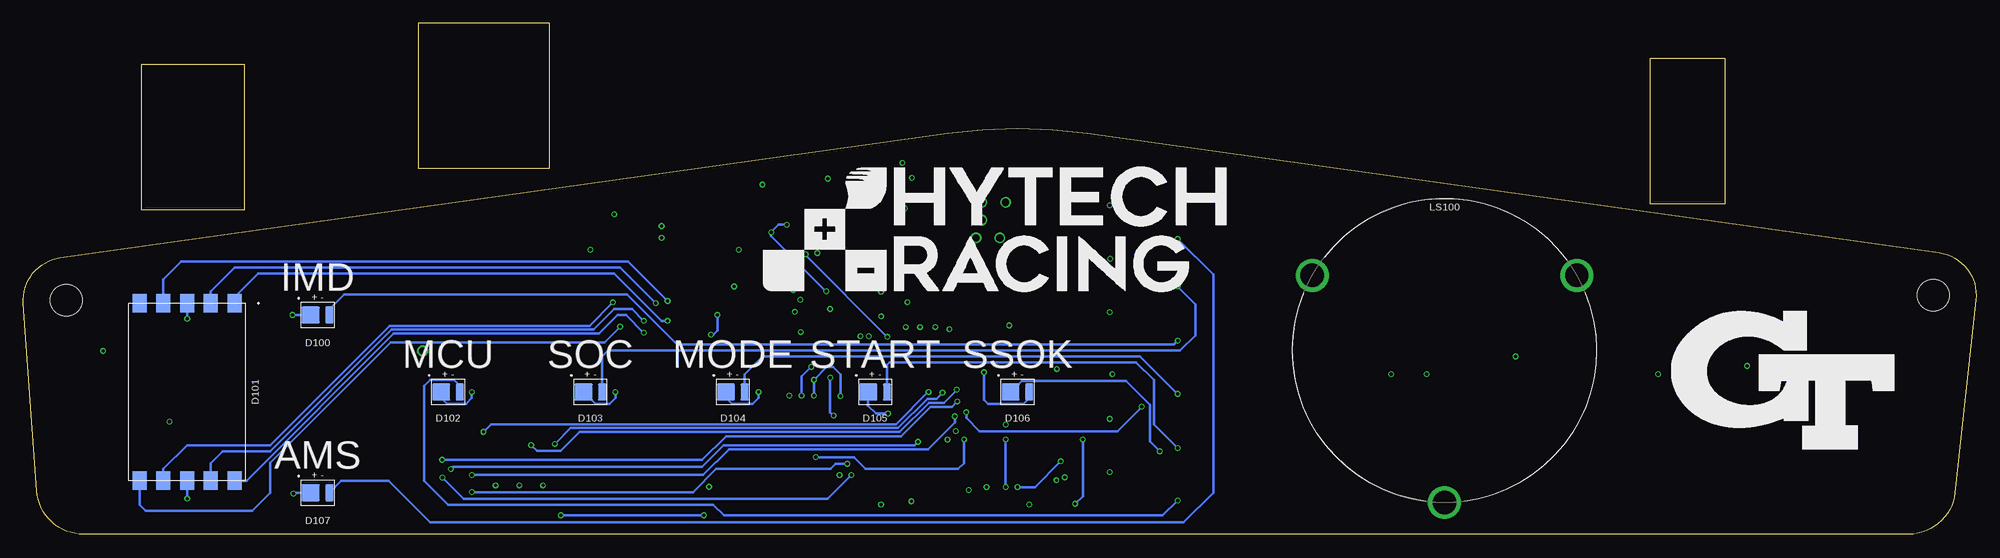
[diagram p5: board, bottom side, seen from below]

Size 209.07 x 43.5 mm. Coordinates in mm from the lower left corner, seen from the top.
Outline: 3.96,30.16 arc88 0.03,25.11 2.27,4.46 arc84 7.24,0 202.64,0 arc86 207.62,4.64 209.06,24.74 arc86 205.11,29.63 110.14,42.98 arc16 95.14,42.98 3.96,30.16
Copper layers (1+2*15+16): Top 0.035mm / dielectric 0.2mm / Route2 0.0175mm / dielectric 1.065mm / Route15 0.0175mm / dielectric 0.2mm / Bottom 0.035mm
Design rules "JLCPCB (4 Layer)": minimum track width 5mil, minimum drill 0.2mm, track to track 5mil, track to pad 5mil, pad to pad 5mil, via to via 20mil, smd to smd 5mil, copper to edge 0.2mm, drill to drill 21mil, minimum pad ring 6mil, minimum via ring 5mil, stop-mask expansion 2mil, vias tented up to drill 30mil, thermal gap 10mil

### Footprints (pad centres in the part's own frame; a part is rotated, then mirrored left to right if it is on the bottom)
OKL-T/1-W12 = smd 1.27 x 1.27: 1 -4.572,0; 5 4.572,0; 6 4.572,-4.572; 7 0,-4.572; 8 -2.286,-4.572; 9 -4.572,-4.572; 10 -4.572,-2.286; 11 4.572,-2.286; 12 2.286,-4.572 | smd 4.318 x 2.032: 2 -3.429,4.572; 3 1.143,4.572 | smd 2.032 x 4.318: 4 4.572,3.429
0603-CAP = smd 0.9 x 0.9: 1 -0.75,0; 2 0.75,0
SOD-323 = smd 0.8 x 0.9: A -1.15,0; C 1.15,0
SOT-23 = smd 0.711 x 0.889: 1 -0.94,-1.003; 2 0.94,-1.003; 3 0,1.003
0603-LED = smd 0.8 x 0.8: 1 -0.825,0; 2 0.825,0
2835-LED = smd 1.93 x 1.8: A -0.735,0 | smd 0.87 x 1.8: C 1.265,0
DSM7T = smd 1.5 x 2: 1 -5.08,-9.5; 2 -2.54,-9.5; 3 0,-9.5; 4 2.54,-9.5; 5 5.08,-9.5; 6 5.08,9.5; 7 2.54,9.5; 8 0,9.5; 9 -2.54,9.5; 10 -5.08,9.5
SOT-363 = smd 0.42 x 0.6: 1 -0.673,-0.95; 2 0,-0.95; 3 0.65,-0.95; 4 0.65,0.95; 5 0,0.95; 6 -0.65,0.95
2X05_SMD = smd 1.27 x 5.08: 1 -5.08,-3.175; 2 -5.08,3.175; 3 -2.54,-3.175; 4 -2.54,3.175; 5 0,-3.175; 6 0,3.175; 7 2.54,-3.175; 8 2.54,3.175; 9 5.08,-3.175; 10 5.08,3.175
MOLEX_MICROFIT_SMD_RIGHTANGLE_06_DUAL = smd 1.27 x 2.921: 1 3,5.474; 2 0,5.474; 3 -3,5.474; 4 3,10.097; 5 0,10.097; 6 -3,10.097 | smd 3.429 x 1.651: PAD1 6.886,0; PAD2 -6.886,0
MOLEX_MICROFIT_SMD_RIGHTANGLE_04_DUAL = smd 1.27 x 2.921: 1 1.5,5.474; 2 -1.5,5.474; 3 1.5,10.097; 4 -1.5,10.097 | smd 3.429 x 1.651: PAD1 5.386,0; PAD2 -5.386,0
MOLEX_MICROFIT_SMD_RIGHTANGLE_08_DUAL = smd 1.27 x 2.921: 1 4.5,5.474; 2 1.5,5.474; 3 -1.5,5.474; 4 -4.5,5.474; 5 4.5,10.097; 6 1.5,10.097; 7 -1.5,10.097; 8 -4.5,10.097 | smd 3.429 x 1.651: PAD1 8.386,0; PAD2 -8.386,0
0603-RES = smd 0.9 x 0.8: 1 -0.85,0; 2 0.85,0
0603-IND = smd 0.65 x 0.7: 1 -0.675,0; 2 0.675,0
CPT-3011C-120 = drill 2.5: F 14.162,8.051; G -14.162,8.051; M 0,-16.29
0805-RES = smd 0.9 x 1.2: 1 -1.05,0; 2 1.05,0
1206-RES-ARRAY = smd 0.45 x 0.9: 1 -1.2,-0.9; 2 -0.4,-0.9; 3 0.4,-0.9; 4 1.2,-0.9; 5 1.2,0.9; 6 0.4,0.9; 7 -0.4,0.9; 8 -1.2,0.9
5015 = smd 3.429 x 1.778: 1 0,0
TQFP-32 = smd 1.55 x 0.55: 1 -4.2,2.8; 2 -4.2,2; 3 -4.2,1.2; 4 -4.2,0.4; 5 -4.2,-0.4; 6 -4.2,-1.2; 7 -4.2,-2; 8 -4.2,-2.8; 17 4.2,-2.8; 18 4.2,-2; 19 4.2,-1.2; 20 4.2,-0.4; 21 4.2,0.4; 22 4.2,1.2; 23 4.2,2; 24 4.2,2.8 | smd 0.55 x 1.55: 9 -2.8,-4.2; 10 -2,-4.2; 11 -1.2,-4.2; 12 -0.4,-4.2; 13 0.4,-4.2; 14 1.2,-4.2; 15 2,-4.2; 16 2.8,-4.2; 25 2.8,4.2; 26 2,4.2; 27 1.2,4.2; 28 0.4,4.2; 29 -0.4,4.2; 30 -1.2,4.2; 31 -2,4.2; 32 -2.8,4.2
SOIC-08(NARROW,0.15") = smd 0.762 x 1.143: 1 -1.905,-2.603; 2 -0.635,-2.603; 3 0.635,-2.603; 4 1.905,-2.603; 5 1.905,2.603; 6 0.635,2.603; 7 -0.635,2.603; 8 -1.905,2.603
SSOP-20 = smd 0.45 x 1.37: 1 -2.925,-3.6; 2 -2.275,-3.6; 3 -1.625,-3.6; 4 -0.975,-3.6; 5 -0.325,-3.6; 6 0.325,-3.6; 7 0.975,-3.6; 8 1.625,-3.6; 9 2.275,-3.6; 10 2.925,-3.6; 11 2.925,3.6; 12 2.275,3.6; 13 1.625,3.6; 14 0.975,3.6; 15 0.325,3.6; 16 -0.325,3.6; 17 -0.975,3.6; 18 -1.625,3.6; 19 -2.275,3.6; 20 -2.925,3.6
TSSOP-20 = smd 0.45 x 1.05: 1 -2.925,-2.775; 2 -2.275,-2.775; 3 -1.625,-2.775; 4 -0.975,-2.775; 5 -0.325,-2.775; 6 0.325,-2.775; 7 0.975,-2.775; 8 1.625,-2.775; 9 2.275,-2.775; 10 2.925,-2.775; 11 2.925,2.775; 12 2.275,2.775; 13 1.625,2.775; 14 0.975,2.775; 15 0.325,2.775; 16 -0.325,2.775; 17 -0.975,2.775; 18 -1.625,2.775; 19 -2.275,2.775; 20 -2.925,2.775
MOUNTING_M3 = hole 3.4: 0,0
ECX-42 = smd 1.4 x 1.15: 1 -1.5,-0.8; 2 1.5,-0.8; 3 1.5,0.8; 4 -1.5,0.8
3588 = smd 1.575 x 2.819: 1 -4.953,3.035; 2 -4.953,-3.035; 3 4.953,-3.035; 4 4.953,3.035

### Placement (x,y rotation side)
A1  104.54,34.29 0 top
C1  115.34,3.17 270 top
C2  105.96,3.17 90 top
C3  56.92,8.26 90 top
C4  201.47,17.78 270 top
C5  50.57,19.68 90 top
C6  116.49,20.04 0 top
C7  111.5,20.29 90 top
C8  201.47,21.59 270 top
C9  116.49,22.2 0 top
C10  122.57,22.23 270 top
C11  120.87,22.25 270 top
C12  116.49,24.87 0 top
C13  134.39,30.48 180 top
C14  123.52,31.37 180 top
C15  139.36,33.02 90 top
C16  137.56,33.02 90 top
C17  113.43,34.92 90 top
C18  121.69,38.1 270 top
C19  112.85,38.96 270 top
D1  158.52,14.61 270 top
D2  155.98,14.61 270 top
D3  153.44,14.61 270 top
D4  20.82,18.97 90 top
D5  107.72,19.05 0 top
D6  116.61,34.92 90 top
D7  85.49,38.1 180 top
D100  177.57,23.5 0 bottom
D101  191.54,15.24 180 bottom
D102  163.6,15.24 0 bottom
D103  148.36,15.24 0 bottom
D104  133.12,15.24 0 bottom
D105  117.88,15.24 0 bottom
D106  102.64,15.24 0 bottom
D107  177.57,4.45 0 bottom
DN1  100.73,3.17 180 top
DN2  100.73,12.7 90 top
J1  128.67,8.26 180 top
J2  190.9,24.77 180 top
J3  30.88,25.4 180 top
J4  159.79,29.21 180 top
J5  134.39,34.29 180 top
L1  113.07,20.29 90 top
LS100  56.92,19.68 0 bottom
Q1  90.57,5.71 90 top
Q2  90.57,11.43 90 top
Q3  90.57,17.14 90 top
Q4  90.57,22.86 90 top
Q5  90.57,28.57 90 top
Q6  90.57,34.29 90 top
R1  85.49,5.71 90 top
R2  158.52,7.62 270 top
R3  155.98,7.62 270 top
R4  153.44,7.62 270 top
R5  158.52,11.2 270 top
R6  155.98,11.2 270 top
R7  153.44,11.2 270 top
R8  85.49,11.43 90 top
R9  118.51,12.06 0 top
R10  54.99,15.06 180 top
R11  127.91,16 0 top
R12  85.49,17.14 90 top
R13  62,19.05 90 top
R14  104.36,20.95 180 top
R15  42.74,22.83 90 top
R16  85.49,22.86 90 top
R17  85.49,28.57 90 top
R18  137.56,30.48 0 top
R19  112.8,30.48 270 top
R20  134.39,32.38 180 top
R21  123.59,33.02 0 top
R22  85.49,34.29 90 top
RN1  100.73,6.99 270 top
RN2  95.65,8.26 90 top
RN3  119.07,15.21 270 top
RN4  100.73,15.88 270 top
RN5  137.56,20.95 270 top
RN6  107.72,22.86 180 top
RN7  137.56,25.4 270 top
RN8  95.65,28.57 90 top
TP1  77.87,8.89 0 top
TP2  16.28,22.86 0 top
TP3  118.51,27.94 0 top
TP4  16.28,18.41 0 top
U1  110.89,12.7 90 top
U2  55.01,19.05 270 top
U3  128.04,24.13 270 top
U4  144.55,32.38 270 top
U5  128.67,34.29 90 top
U$1  [MOUNTING_M3]  204.47,25.07 0 top
U$2  [MOUNTING_M3]  4.6,25.61 0 top
U$3  [LOGO_HYTECH_SQUARE_EXTRA_LARGE]  12.47,8.89 0 top
U$100  [LOGO_HYTECH_LARGE]  129.94,26.04 0 bottom
U$101  [LOGO_GT_LARGE]  20.72,16.51 0 bottom
X1  110.87,4.34 0 top
X2  117.9,38.38 180 top
XF1  176.3,24.13 90 top

### Tracks (layer width: path | path; a pad name or v marks a point on that pad's centre or on a via)
+5V  (via drill 0.35, 0.76)
  Top 0.254: C16.1 C15.1 139.88,31.75 v140.74,31.75 U4.3 | C4.1 202.1,18.53 202.64,19.06 202.64,21.81 202.1,22.34 C8.1 200.72,23.09 v191.54,23.09 | J1.2 v135.66,5.08 | v114.42,24.87 C12.1 115.74,25.49 116.95,26.69 117.26,26.69 TP3.1 | C9.1 v114.6,22.2 | L1.2 v113.07,22.2 | U1.4 110.49,9.43 110.74,9.68 | 110.74,9.68 111.8,9.68 112.09,9.39 U1.6 | 110.74,9.68 110.59,9.68 v110.13,10.13 | v122.7,24.13 122.7,23.1 C10.1 120.9,22.98 C11.1 | U3.20 132.47,27.05 v132.99,26.54 | U3.6 126.47,23.8 v126.49,23.82 | U5.20 C14.1 124.06,31.16 v124.06,30.14 | R21.1 v121.53,33.02 | U4.5 v148.36,30.48 | R11.1 127.07,15.99 v127.07,14.86
  Top 0.508: 111.53,37.21 111.53,34.92 112.28,34.17 C17.1 | 111.53,37.21 112.19,36.55 114.3,36.55 114.66,36.18 115.73,36.18 116.16,35.75 D6.2 | v106.45,35.56 107.72,36.83 | 107.72,36.83 108.6,37.72 A1.4 111.02,37.72 111.53,37.21 | 107.72,36.83 107.72,34.92 v106.45,33.66
  Bottom 0.254: D101.8 v191.54,3.81 | v180.26,23.5 D100.A | D103.A 147.82,13.97 146.32,13.97 145.69,14.61 v145.69,15.24 | D105.A 118.61,13.77 117.77,12.93 v116.5,12.93 | D104.A 133.85,14.61 133.22,13.97 130.99,13.97 130.36,14.61 v130.36,15.24 | D102.A 164.33,14.61 163.7,13.97 161.69,13.97 161.06,14.61 v161.06,15.24 | v191.54,23.09 D101.3 | D107.A 180.08,4.45 v180.16,4.37
  pour Route15: -0.23,26.67 -0.23,-0.64 208.68,-0.64 209.32,0 209.32,29.21 194.71,43.81 103.27,43.81 13.74,43.81 -0.23,29.84
+12V
  Top 0.254: C5.2 51.32,19.68 U2.2
  Top 0.508: 46.76,32.38 74.06,32.38 79.78,38.1 D7.2 87.73,41.16 98.81,41.16 98.83,41.15 | 46.76,32.38 48.03,31.11 48.03,21.7 49.3,20.43 C5.2 | XF1.3 XF1.4 170.42,31.93 168.43,31.93 166.07,34.29 154.07,34.29 152.17,36.2 134.19,36.2 131.62,38.76 127.46,38.76 126.33,39.88 121.88,39.88 121.13,40.64 113.43,40.64 112.16,41.91 99.46,41.91 98.83,41.27 98.83,41.15 | 22.13,22.37 21.99,22.51 21.99,25.4 | 22.13,22.37 24.58,19.93 J3.1 | 21.99,25.4 21.99,28.73 25.65,32.38 46.76,32.38 | D4.3 19.82,20.05 22.13,22.37 | A1.2 98.83,41.15 | TP2.1 19.45,22.86 21.99,25.4
A2
  Top 0.254: RN7.1 134.28,28.98 129.71,28.98 128.77,28.04 128.77,23.5 130.41,21.86 U3.12
B2
  Top 0.254: RN7.2 136.25,25.8 133.47,28.57 130.07,28.57 129.18,27.69 129.18,23.8 130.47,22.5 U3.13
BTN_LAUNCH_READ  (via drill 0.35)
  Top 0.254: v161.06,6.35 161.06,8.26 164.23,11.43 180.11,11.43 187.9,19.23 J2.1 | U1.26 107.55,14.7 109.34,12.91 v109.34,12.63
  Bottom 0.254: v109.34,12.63 109.34,11.99 112.22,9.12 133.52,9.12 136.29,6.35 v161.06,6.35
BTN_MARK_READ  (via drill 0.35)
  Top 0.254: v120.42,6.35 116.07,10.7 U1.10 | v164.21,6.07 187.73,6.07 190.9,9.25 J2.5
  Bottom 0.254: v164.21,6.07 161.94,3.81 122.96,3.81 v120.42,6.35
BTN_MC_CYCLE_READ  (via drill 0.35)
  Top 0.254: v113.28,9.91 113.28,12.3 114.06,13.08 115.07,13.08 U1.13 | v163.32,6.99 185.3,6.99 187.9,9.59 J2.4
  Bottom 0.254: v113.28,9.91 113.66,9.53 134.11,9.53 136.39,7.24 163.06,7.24 v163.32,6.99
BTN_MODE_READ  (via drill 0.35)
  Top 0.254: v120.85,7.54 116.89,11.5 U1.11 | v161.06,4.52 161.64,4.52 162.22,5.11 190.93,5.11 195.17,9.35 195.17,18.02 J2.3
  Bottom 0.254: v161.06,4.52 137.36,4.52 134.89,6.99 122.68,6.99 122.12,7.54 v120.85,7.54
BTN_START_READ  (via drill 0.35)
  Top 0.254: v109.09,14.22 107.81,15.5 U1.25 | v164.23,7.98 178.26,7.98 187.03,16.75 189.63,16.75 190.9,18.02 J2.2
  Bottom 0.254: v109.09,14.22 109.65,13.66 111.93,13.66 115.08,10.52 133.85,10.52 136.39,7.98 v164.23,7.98
BUZZER_CTRL  (via drill 0.35)
  Top 0.254: v89.33,13.66 68.23,13.66 R13.2 60.94,20.95 U2.8 | v108.11,13.07 108.11,13.53 107.73,13.9 U1.27
  Bottom 0.254: v89.33,13.66 91.94,11.05 106.7,11.05 108.11,12.46 v108.11,13.07
C2
  Top 0.254: RN7.3 136.28,25 133.12,28.17 130.3,28.17 129.58,27.46 129.58,24.08 130.51,23.16 U3.14
CANH
  Top 0.254: J3.4 32.38,12.26 31.09,10.97 31.09,9.95 39.95,1.09 136.31,1.09 149.63,14.4 149.63,23.5 145.18,27.94 145.18,32.38 145.82,33.02 U4.7 147.72,33.02 148.36,32.38 156.46,32.38 162.96,25.88 162.96,25.06 J4.4
CANL
  Top 0.254: J3.3 29.38,12.34 30.69,11.03 30.69,9.72 39.75,0.66 136.6,0.66 150.03,14.1 150.03,23.72 145.82,27.94 145.82,31.11 146.45,31.75 U4.6 156.36,31.75 162.33,25.78 162.33,24.78 J4.3
D2
  Top 0.254: RN7.4 136.35,24.2 132.79,27.76 130.65,27.76 129.99,27.1 129.99,24.56 130.75,23.8 U3.15
E2
  Top 0.254: U3.16 132.41,24.45 134.71,22.16 RN5.1
F2  (via drill 0.35)
  Top 0.254: U3.17 133.16,25.11 v134.77,23.5 | v135.45,21.37 136.65,21.37 RN5.2
  Bottom 0.254: v134.77,23.5 134.77,21.84 135.24,21.37 v135.45,21.37
G2
  Top 0.254: RN5.3 137.36,20.55 137.57,20.76 137.57,22.82 137.15,23.24 136.16,23.24 133.65,25.75 U3.18
GND  (via drill 0.35, 0.76)
  Top 0.254: C13.2 v132.48,30.48 | RN4.2 RN4.1 99.05,17.07 v98.42,17.7 | v129.94,37.47 130.19,37.22 U5.10 | Q6.2 v92.75,35.23 | Q5.2 v92.7,29.52 | Q4.2 v92.78,23.8 | v92.75,12.37 Q2.2 | v62.63,17.14 62.63,17.57 R13.1 | v92.75,6.66 Q1.2 | RN1.3 98.43,6.58 | 98.43,6.58 98.04,6.58 v97.57,6.11 | 98.43,6.58 99.23,7.38 RN1.2 RN1.1 | DN1.2 100.73,3.41 100.96,3.19 v101.38,3.19 | v109.93,21.97 RN6.8 RN6.7 108.12,22.46 107.32,23.26 RN6.3 | C6.2 118.41,21.21 v118.56,21.21 | C9.2 117.24,23.34 v117.24,23.35 | C12.2 v117.24,25.98 | C17.2 113.95,35.67 v114.7,34.92 | v119.45,21.21 119.74,21.5 C11.2 120.9,21.48 C10.2 | C18.2 122.44,38.1 v122.96,38.1 | Q3.2 92.48,17.18 v92.48,17.14 | v111.45,22.2 111.45,21.09 C7.2 110.49,20.04 U1.21 | U2.5 v58.82,17.14 | X1.4 108.26,5.14 v107.84,4.72 | X1.2 113.98,3.54 v113.99,3.53 | v117.24,3.17 116.49,2.42 C1.2 | X2.4 119.45,37.53 v119.45,36.37 | X2.2 115.78,39.8 v114.95,39.8 | J2.6 193.9,12.53 v193.44,12.06 | DN2.2 101.29,12.7 101.02,12.44 101.02,11.77 101.37,11.43 103.58,11.43 v103.91,11.76 | C5.1 49.41,18.93 v49.3,19.05 | U1.5 111.29,7.54 111.14,7.39 109.87,7.39 109.69,7.58 U1.3 109.69,9.39 109.25,9.82 v109.25,11.06 | J1.4 J1.6 J1.8 J1.10 122.32,6.35 v121.69,6.35 | U3.5 U3.4 125.89,25.11 v125.9,25.12 | U3.9 125.63,21.86 v125.82,21.66 | v113.94,38.2 112.86,38.2 C19.2 | RN1.4 98.6,5.79 v98.47,5.79 | R14.2 103.51,22.37 v103.52,22.38 | v34.06,17.14 34.06,18.25 J3.2 | R2.2 v158.52,5.23 | R3.2 v155.98,5.23 | R4.2 v153.44,5.23 | U4.8 v145.82,34.29 | C16.2 C15.2 140.11,33.02 v140.74,33.02 U4.2 | C14.2 v121.54,31.37 v121.53,31.37 | C4.2 200.53,17.97 v200.53,19.63 200.53,19.9 C8.2 | v105.96,5.05 105.96,3.93 C2.2 | v24.53,18.03 D4.1 21.99,17.86 21.99,17.14 21.36,16.51 18.18,16.51 TP4.1
  Top 0.508: R19.1 112.8,32.38 112.16,33.02 109.62,33.02 109.11,32.51 A1.11 108.86,31.75 v107.08,31.75 | A1.7 v104.54,31.75 | A1.3 105.68,37.34 v103.91,35.56 | v166.31,19.63 165.79,19.11 J4.8
  pour Route2: 2.27,4.46 0.03,25.11 arc-88 3.96,30.16 95.14,42.98 arc-16 110.14,42.98 205.11,29.63 arc-86 209.06,24.74 207.62,4.64 arc-86 202.64,0 7.24,0 arc-84
INERTIA
  Top 0.254: D2.A 158.29,18.07 J4.6
INERTIA_READ  (via drill 0.35)
  Top 0.254: v109.13,15.49 108.85,15.49 108.09,16.25 U1.24 | 155.98,10.16 R6.2 | v154.71,9.55 155.36,9.55 155.98,10.16 | R3.1 155.98,10.16
  Bottom 0.254: v109.13,15.49 110.53,14.1 112.1,14.1 115.25,10.95 149.5,10.95 151.53,8.91 154.07,8.91 v154.71,9.55
LED_AMS_CTRL  (via drill 0.35)
  Top 0.254: RN4.7 101.13,16.27 100.73,15.88 | 100.73,15.88 100.58,15.72 100.58,11.58 101.37,10.79 103.27,10.79 v103.91,10.16 105.25,11.5 U1.30 | 100.73,15.88 100.73,23.72 97.08,27.38 RN8.1 | DN1.6 102.35,2.23 103.91,3.79 v103.91,5.05
  Bottom 0.254: v103.91,5.05 v103.91,10.16
LED_IMD_CTRL  (via drill 0.35)
  Top 0.254: DN1.4 97.52,2.23 v96.47,3.27 | U1.31 105.72,10.7 103.2,8.19 RN1.8 101.44,8.37 101.44,9.01 101,9.46 RN2.4 96.55,9.89 96.29,10.16 v95.65,10.16
  Bottom 0.254: v96.47,3.27 95.65,4.09 v95.65,10.16
LED_MC_ERR_CTRL
  Top 0.254: U1.1 108.09,7.41 107.27,6.58 RN1.6 100.97,6.58 100.73,6.35 100.73,5.41 100.74,5.4 100.08,4.75 DN1.3 97.97,4.12 96.55,5.55 RN2.1
LED_MODE_CTRL
  Top 0.254: DN1.5 100.73,2.53 100.28,2.98 98.54,2.98 95.66,5.87 95.66,8.08 96.24,8.65 RN2.3 98.6,8.65 98.99,9.04 100.54,9.04 100.74,8.85 100.74,7.83 101.19,7.38 RN1.7 103.04,7.38 105.55,9.9 U1.32
LED_START_CTRL  (via drill 0.35)
  Top 0.254: RN2.2 98.01,7.86 v98.01,7.82 | U1.2 108.99,8.4 108.99,7.62 107.15,5.79 RN1.5 101.63,5.45 102,5.08 102.61,5.08 v102.64,5.05 102.64,4.42 102.34,4.12 DN1.1
  Bottom 0.254: v98.01,7.82 100.78,5.05 v102.64,5.05
N$1
  Top 0.254: U5.9 128.58,36.56 126.29,38.85 C18.1 121.67,38.84 121.05,38.84 120.71,39.18 X2.1
N$2  (via drill 0.35)
  Top 0.254: R1.1 v85.49,3.61
  Bottom 0.254: v85.49,3.61 87.09,2.01 134.08,2.01 135.24,3.17 163.59,3.17 166.14,5.71 166.14,15.88 165.5,16.51 162.97,16.51 162.33,15.88 D102.C
N$3
  Top 0.254: X1.3 114.12,5.14 | C1.1 114.12,5.14 | 114.12,5.14 113.69,5.57 U1.8
N$4
  Top 0.254: U1.20 111.27,16.93 111.27,19.31 C7.1
N$5
  Top 0.254: Q1.3 88.03,5.71 87.18,6.57 R1.2
N$6
  Top 0.254: Q3.3 88.03,17.14 87.18,18 R12.2
N$7
  Top 0.254: Q4.3 88.03,22.86 86.98,23.91 R16.2
N$8
  Top 0.254: Q6.3 88.03,34.29 86.98,35.34 R22.2
N$9
  Top 0.254: Q5.3 88.03,28.57 87.18,29.43 R17.2
N$10
  Top 0.254: RN2.7 94.15,7.86 91.57,10.43 Q2.1
N$11
  Top 0.254: 106.6,2.42 108.25,2.42 X1.1 | 106.6,2.42 C2.1 | 106.6,2.42 106.6,2.44 107.08,2.92 107.08,5.08 108.99,6.99 112.54,6.99 112.89,7.33 U1.7
N$12  (via drill 0.35)
  Top 0.254: 127.55,26.67 127.55,28.42 126.77,29.21 122.32,29.21 120.42,31.11 120.42,33.66 122.03,35.27 U5.14 | v125.75,14.86 126.13,14.48 J1.7 | U3.1 127.17,27.05 127.55,26.67 | 127.55,26.67 127.55,20.76 v124.72,17.92 124.65,17.92 123.59,16.87 123.59,16.51 123.1,16.02 121.54,16.02 121.15,16.41 RN3.8
  Bottom 0.254: v124.72,17.92 125.75,16.89 v125.75,14.86
N$13  (via drill 0.35)
  Top 0.254: v145.97,24.84 144.21,26.6 RN7.8
  Bottom 0.254: v145.97,24.84 148.47,22.34 169.83,22.34 182.65,9.53 191.54,9.53 194.08,6.99 D101.7
N$14  (via drill 0.35)
  Top 0.254: RN7.7 141.61,25.8 v145.18,22.23
  Bottom 0.254: D101.6 196.62,3.17 195.98,2.54 184.55,2.54 182.65,4.45 182.65,7.64 169.74,20.55 146.86,20.55 v145.18,22.23
N$15  (via drill 0.35)
  Top 0.254: RN7.6 v140.1,25
  Bottom 0.254: D101.4 194.08,27.3 192.17,29.21 144.31,29.21 v140.1,25
N$16  (via drill 0.35)
  Top 0.254: RN5.6 141.61,20.55 v142.64,21.59
  Bottom 0.254: D101.10 185.16,5.74 169.41,21.49 147.45,21.49 145.44,23.49 144.54,23.49 v142.64,21.59
N$17  (via drill 0.35)
  Top 0.254: RN5.7 141.14,21.36 v142.64,22.86
  Bottom 0.254: D101.9 189,7.62 187.73,8.89 182.65,8.89 169.62,21.92 148.03,21.92 145.82,24.13 143.91,24.13 v142.64,22.86
N$18  (via drill 0.35)
  Top 0.254: RN5.8 139.17,22.86 v140.1,22.86
  Bottom 0.254: D101.1 186.46,25.4 183.92,27.94 145.82,27.94 140.74,22.86 v140.1,22.86
N$19  (via drill 0.35)
  Top 0.254: RN7.5 140.81,24.2 v141.37,24.77
  Bottom 0.254: D101.2 189,26.04 186.46,28.57 145.18,28.57 v141.37,24.77
N$20
  Top 0.254: U1.14 116.59,13.9 116.7,14.02 RN3.4
N$21
  Top 0.254: RN6.1 116.61,31.45 D6.1
N$22
  Top 0.254: RN2.8 92.47,4.78 Q1.1
N$23  (via drill 0.35)
  Top 0.254: v127.34,33.16 127.02,33.16 126.86,33.31 U5.17 | v129,32.36 129,29.67 128.37,29.03 128.37,19.28 124.69,15.6 122.32,15.6 | 122.32,15.6 123.59,14.33 J1.9 | U3.3 123.39,25.75 v123.11,26.04 | RN3.7 122.31,15.62 122.32,15.6
  Bottom 0.254: v127.34,33.16 128.21,33.16 v129,32.36 129,31.93 v123.11,26.04
N$24  (via drill 0.35)
  Top 0.254: R12.1 v85.49,15.04
  Bottom 0.254: v85.49,15.04 89.5,19.05 129.94,19.05 131.85,17.14 D104.C
N$25  (via drill 0.35)
  Top 0.254: R16.1 85.47,21.79 v85.47,20.73
  Bottom 0.254: D100.C 176.3,24.12 174.72,25.7 144.45,25.7 139.07,20.32 85.87,20.32 v85.47,20.73
N$26  (via drill 0.35)
  Top 0.254: v106.22,17.35 105.89,17.68 105.89,20.46 105.4,20.95 R14.1
  Bottom 0.254: D106.C 101.37,14.61 102.01,13.97 105.81,13.97 106.22,14.38 v106.22,17.35
N$27  (via drill 0.35)
  Top 0.254: R22.1 v85.49,31.62
  Bottom 0.254: v85.49,31.62 81.68,27.81 81.68,4.45 84.86,1.27 165.5,1.27 169.95,5.71 175.02,5.71 176.29,4.45 D107.C
N$28
  Top 0.254: U2.7 58.82,19.68 59.61,18.9 59.61,9.68 57.44,7.5 C3.1 LS100.M
N$29
  Top 0.254: U1.12 115.99,12.3 116.22,12.06 R9.1
N$30
  Top 0.508: R19.2 112.8,28.57 112.16,27.94 109.62,27.94 109.11,28.45 A1.6
N$31  (via drill 0.35)
  Top 0.254: R8.1 v85.49,9.25
  Bottom 0.254: D105.C 116.61,18.13 116.33,18.41 89.94,18.41 88.03,16.51 88.03,11.79 v85.49,9.25
N$32
  Top 0.254: R5.1 D1.C
N$33
  Top 0.254: R7.1 D3.C
N$34
  Top 0.254: Q2.3 88.03,11.43 87.18,12.28 R8.2
N$35
  Top 0.254: RN2.5 94.38,9.82 94.38,20.32 92.78,21.92 Q4.1
N$36
  Top 0.254: Q3.1 92.15,16.2 93.75,14.61 93.75,9.02 94.11,8.65 RN2.6
N$37
  Top 0.254: RN8.7 93.98,28.18 93.44,27.64 Q5.1
N$38
  Top 0.254: RN8.8 95.29,27.38 95.65,27.74 95.65,31.75 94.05,33.35 Q6.1
N$39
  Top 0.254: R10.1 55.84,17.78 55.84,17.97 | 55.84,17.97 56.28,18.41 U2.6 | 55.84,17.97 55.84,25.59 57.98,27.74 LS100.G
N$40  (via drill 0.35)
  Top 0.254: R17.1 85.52,27.7 v85.52,26.57
  Bottom 0.254: v85.52,26.57 83.59,24.64 83.59,21.32 85.22,19.68 146.45,19.68 147.09,19.05 D103.C
N$41
  Top 0.254: U5.2 132.11,32.02 132.48,32.38 132.48,33.66 133.12,34.29 J5.2 133.54,34.92 133.64,35.03 134.17,35.56 135.66,35.56 136.29,34.92 136.29,31.75 136.6,31.44 139.17,31.44 140.13,30.48 U4.4
N$42
  Top 0.254: C19.1 113.62,39.71 115.7,37.63 116.35,37.63 X2.3 116.4,37.03 116.91,36.52 118.29,36.52 119.17,35.65 121.64,35.65 123.84,37.85 126.53,37.85 128.46,35.91 U5.8
N$43
  Top 0.508: XF1.2 XF1.1 171.25,21.18 157.84,21.18 J4.1
N$44
  Top 0.254: D5.2 108.89,18.7 U1.23
N$45
  Top 0.254: U1.17 113.69,17.84 113.84,17.98 115.13,17.98 116.7,16.41 RN3.1
N$46
  Top 0.254: R21.2 124.86,32.6 124.86,32.38 125.23,32.02 U5.19
N$47
  Top 0.254: U1.16 116.74,15.5 116.85,15.62 RN3.2
N$48
  Top 0.254: RN3.3 117.94,14.81 117.82,14.7 U1.15
N$50
  Top 0.254: R15.1 47.58,17.14 U2.4 54.14,15.42 R10.2 54.14,11.79 C3.2
N$51
  Top 0.254: J5.1 133.54,32.59 R20.2
N$52
  Top 0.254: R20.1 135.24,31.75 | 135.24,31.75 135.24,30.58 C13.1 | 135.24,31.75 136.51,30.48 R18.1
N$53
  Top 0.254: 139.02,29.82 143.25,29.82 143.91,30.48 143.91,33.66 143.28,34.29 U4.1 | R18.2 139.05,29.84 139.02,29.82 | U5.1 131.45,29.61 131.67,29.39 138.59,29.39 139.02,29.82
N$54
  Top 0.254: LS100.F 42.75,23.7 R15.2
N$56  (via drill 0.35)
  Top 0.254: U5.16 127.8,33.97 128.26,33.5 128.26,30.71 127.98,30.43 v127.98,29.84 127.96,29.82 127.96,19.46 125.04,16.54 v124.43,16.54 | U3.2 125.63,26.41 125.86,26.17 v126.62,26.17 | J1.1 133.75,15.88 132.48,17.14 126.82,17.14 124.53,14.86 v124.43,14.86 | RN3.6 v121.59,14.81
  Bottom 0.254: v127.98,29.84 126.77,28.63 126.77,26.31 v126.62,26.17 | v121.59,14.81 121.59,17.12 122.38,17.9 123.06,17.9 v124.43,16.54 v124.43,14.86
N$57  (via drill 0.35)
  Top 0.254: v116.59,21.15 116.47,21.04 116.47,19.18 116.71,18.95 118.18,18.95 119.06,18.07 119.06,14.53 119.57,14.02 RN3.5 | U5.18 126.49,32.66 126.77,32.38 126.77,30.81 126.21,30.25 125.59,30.25 v125.33,30
  Bottom 0.254: v125.33,30 125.33,29.9 v116.59,21.15
N$59  (via drill 0.35)
  Top 0.254: R9.2 121.69,12.06 v122.32,12.7 | U3.7 126.17,23.16 126.64,22.68 126.64,20.86 122.68,16.91 v122.68,16.78
  Bottom 0.254: v122.68,16.78 122.68,13.06 v122.32,12.7
N$60
  Top 0.254: C6.1 114.85,20.04 113.07,18.27 | 113.07,18.27 112.89,18.08 U1.18 | L1.1 113.07,18.27
N$69
  Top 0.254: D2.C R6.1
RESET  (via drill 0.35)
  Top 0.254: R11.2 128.67,15.91 J1.5 128.67,9.53 127.4,8.26 v124.23,8.26 | U1.29 107.58,12.3 108.35,11.53 v108.35,10.16
  Bottom 0.254: v108.35,10.16 108.35,7.62 108.99,6.99 118.89,6.99 120.15,8.25 v124.22,8.25 v124.23,8.26
SHUTDOWN_H
  Top 0.254: D3.A 153.44,17.26 J4.5
SHUTDOWN_H_READ  (via drill 0.35)
  Top 0.254: v110.66,15.16 110.69,15.14 110.69,15.01 109.69,16.01 U1.22 | R4.1 153.44,10.16 | 153.44,10.16 R7.2 | 153.44,10.16 152.98,9.7 152.19,9.7 v152.17,9.68
  Bottom 0.254: v110.66,15.16 111.32,14.5 112.29,14.5 115.41,11.38 150.46,11.38 v152.17,9.68
SOC
  Top 0.254: RN8.2 97.09,28.18 102.64,22.63 102.64,17.14 | DN2.1 103.07,12.03 104.14,13.1 | U1.28 104.14,13.1 | 102.64,17.14 102.64,14.61 104.14,13.1 | RN4.8 101.7,17.14 102.64,17.14
SSOK  (via drill 0.35)
  Top 0.254: v136.21,2.03 135.68,1.5 85.85,1.5 84.22,3.12 84.22,7.62 | 84.22,7.62 84.73,8.13 86.63,8.13 v87.4,8.89 | v151.53,2.03 154.2,2.03 157.25,5.08 157.25,7.93 157.21,7.97 157.21,12.03 157.23,12.05 157.23,14.61 158.38,15.76 D1.A 161.29,18.52 J4.7 | TP1.1 82.95,8.89 84.22,7.62
  Bottom 0.254: v151.53,2.03 v136.21,2.03 | v87.4,8.89 88.44,9.93 88.44,13.87 91,16.43 102.18,16.43 D106.A
SSOK_READ  (via drill 0.35)
  Top 0.254: v112.16,15.24 112.16,16.83 U1.19 | R2.1 R5.2 159.46,10.35 159.8,10.7 v159.8,10.97
  Bottom 0.254: v112.16,15.24 112.19,15.24 115.65,11.79 158.99,11.79 v159.8,10.97
STATUS_12V
  Top 0.254: D7.1 90.9,38.1 97.53,31.47 97.53,28.86 101.62,24.77 107.72,24.77 108.12,24.36 RN6.2
STATUS_TEENSY
  Top 0.254: D5.1 106.89,20.13 107.32,20.55 RN6.6

### Text on the board
tPlace: HyTech Racing 2022 / Dashboard rev3 / Designed by Youssef Jaafar / Based on rev2 / by Ethan Weinstock
bNames: IMD | SSOK | START | MODE | SOC | MCU | AMS